# EasyEDA Pro project ProProject_Turbo_Drive_2024-05-30.epro

# Schematic Schematic

## Sheets
1 ESP32 S3 N16R8: Create Date: 2024-02-17; Page Name: ESP32 S3 N16R8; Project Name: Turbo; Schematic Name: Schematic; Update Date: 2024-05-26; Company: 嘉立创EDA; Page Size: A4; Version: V1.0
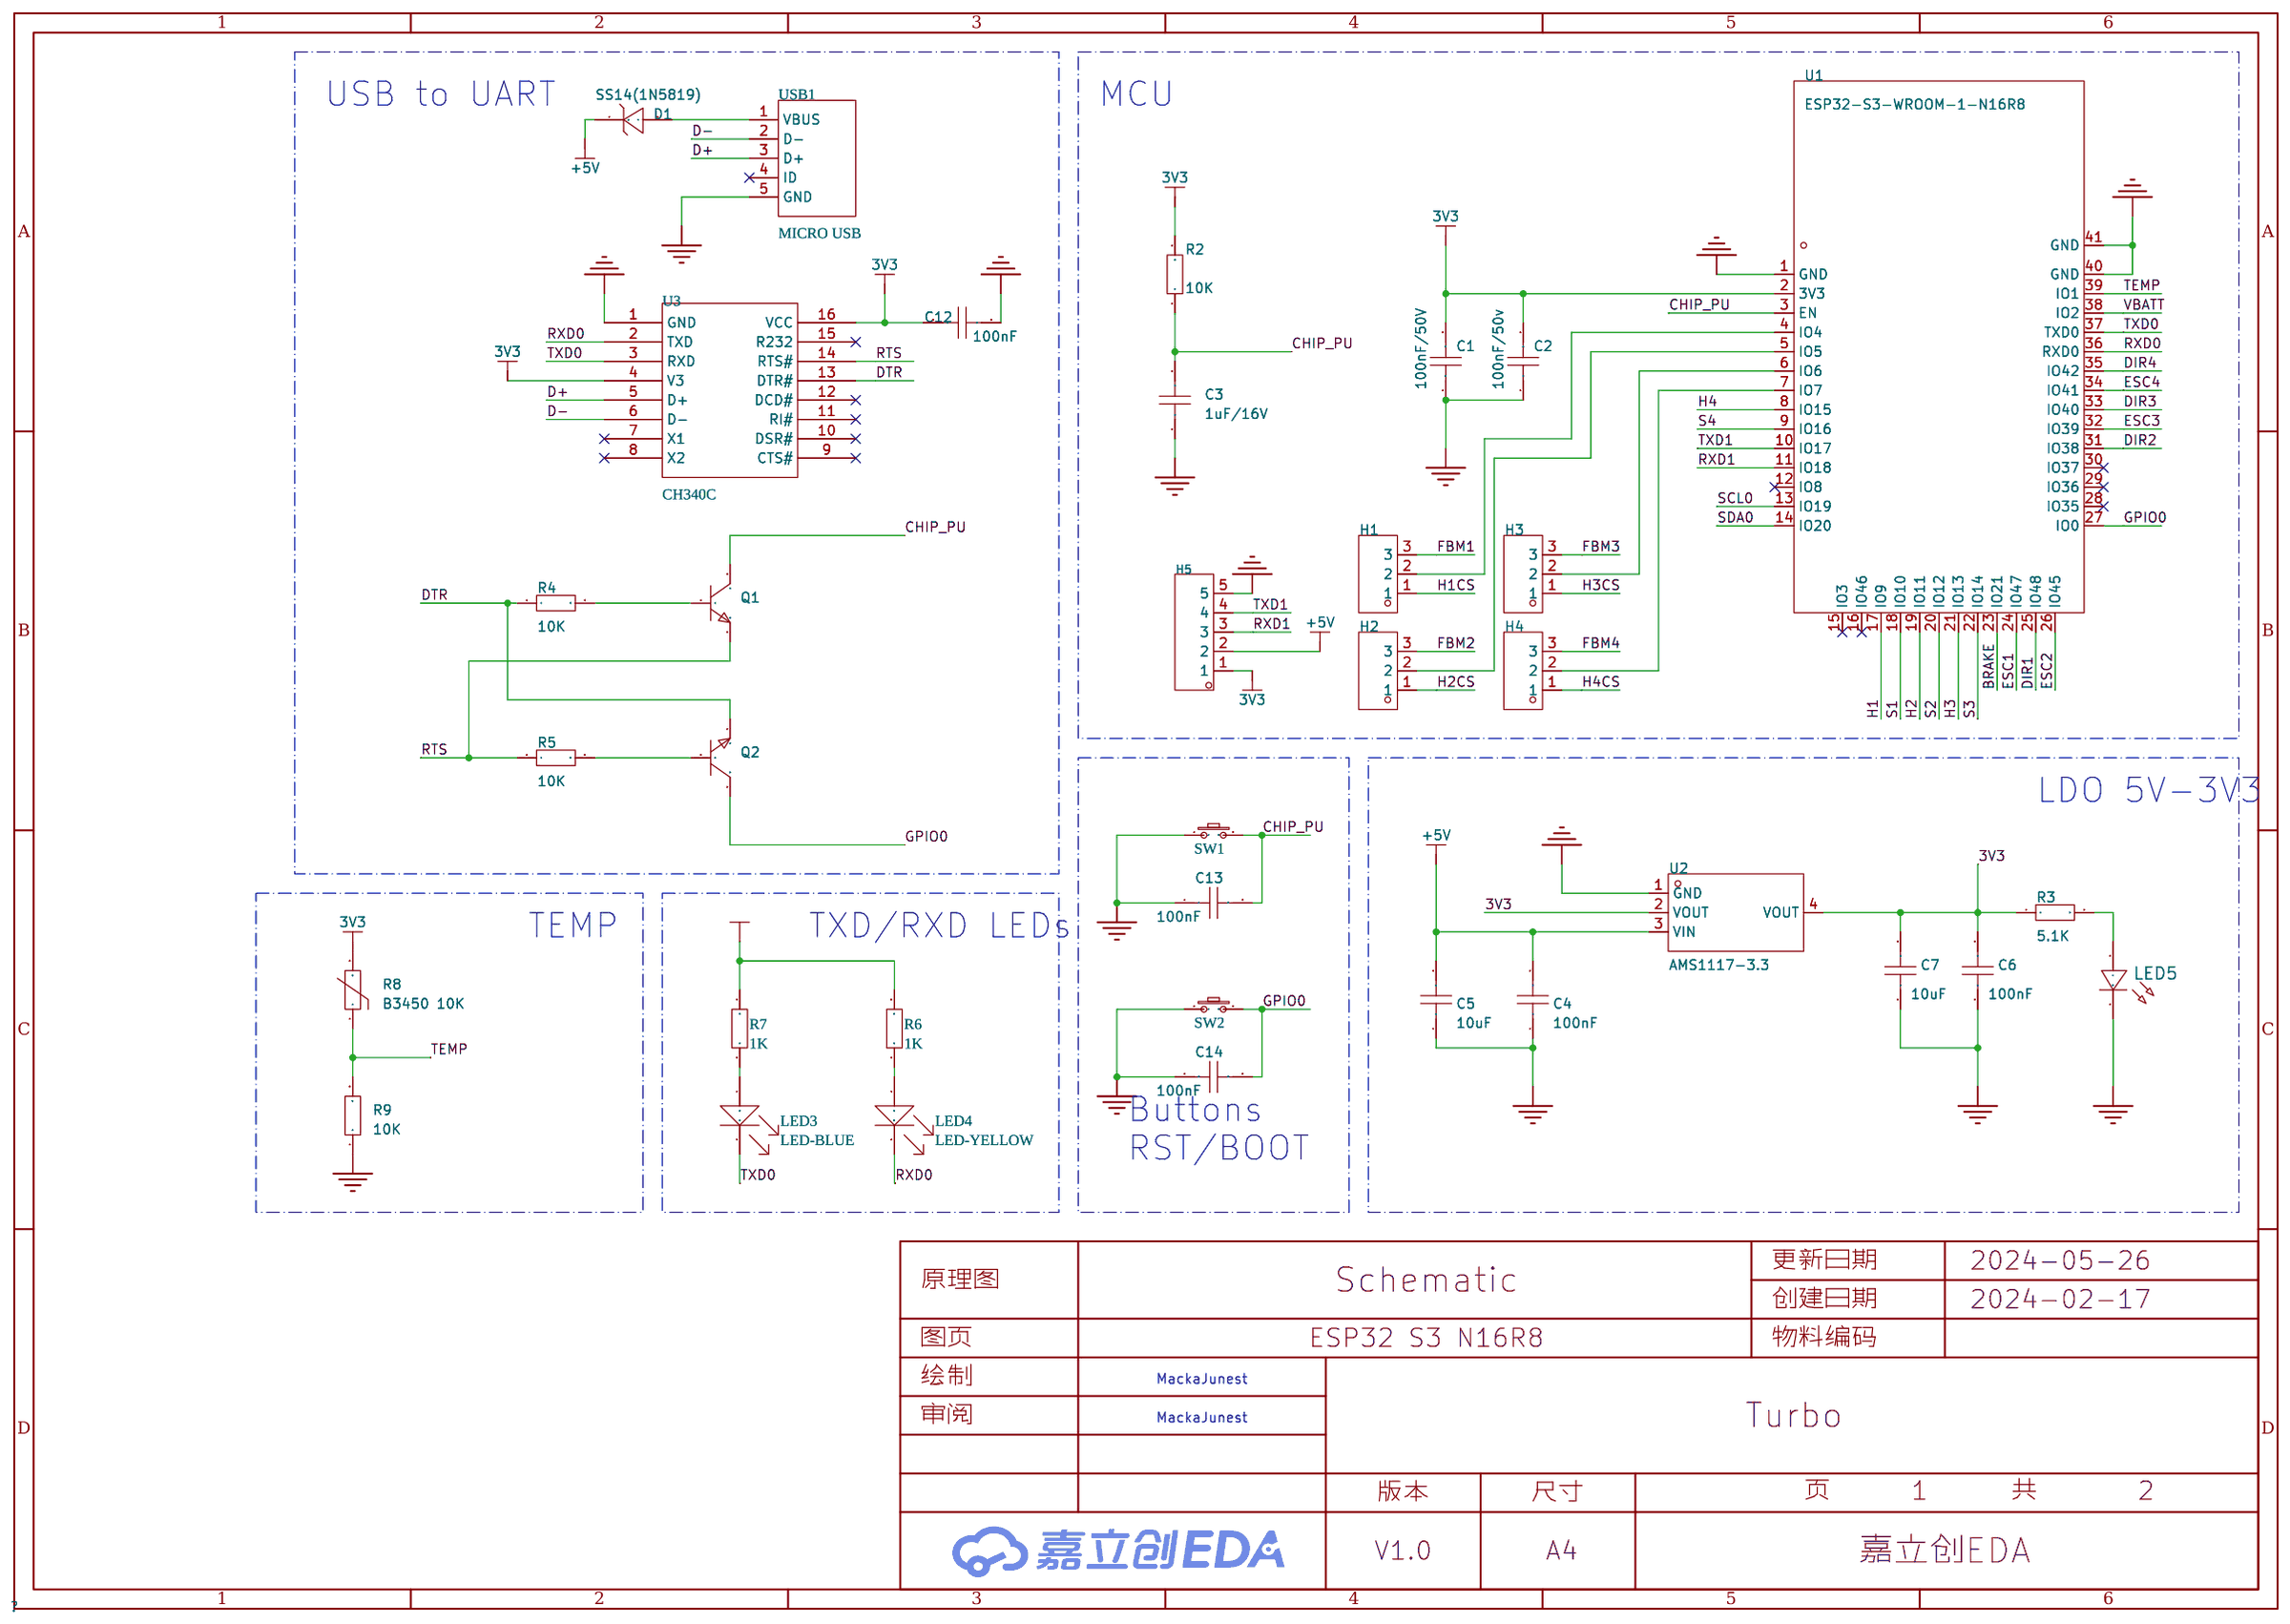
[diagram p0: ESP32 S3 N16R8]
2 Peripheral circuits: Create Date: 2024-02-19; Page Name: Peripheral circuits; Update Date: 2024-03-01
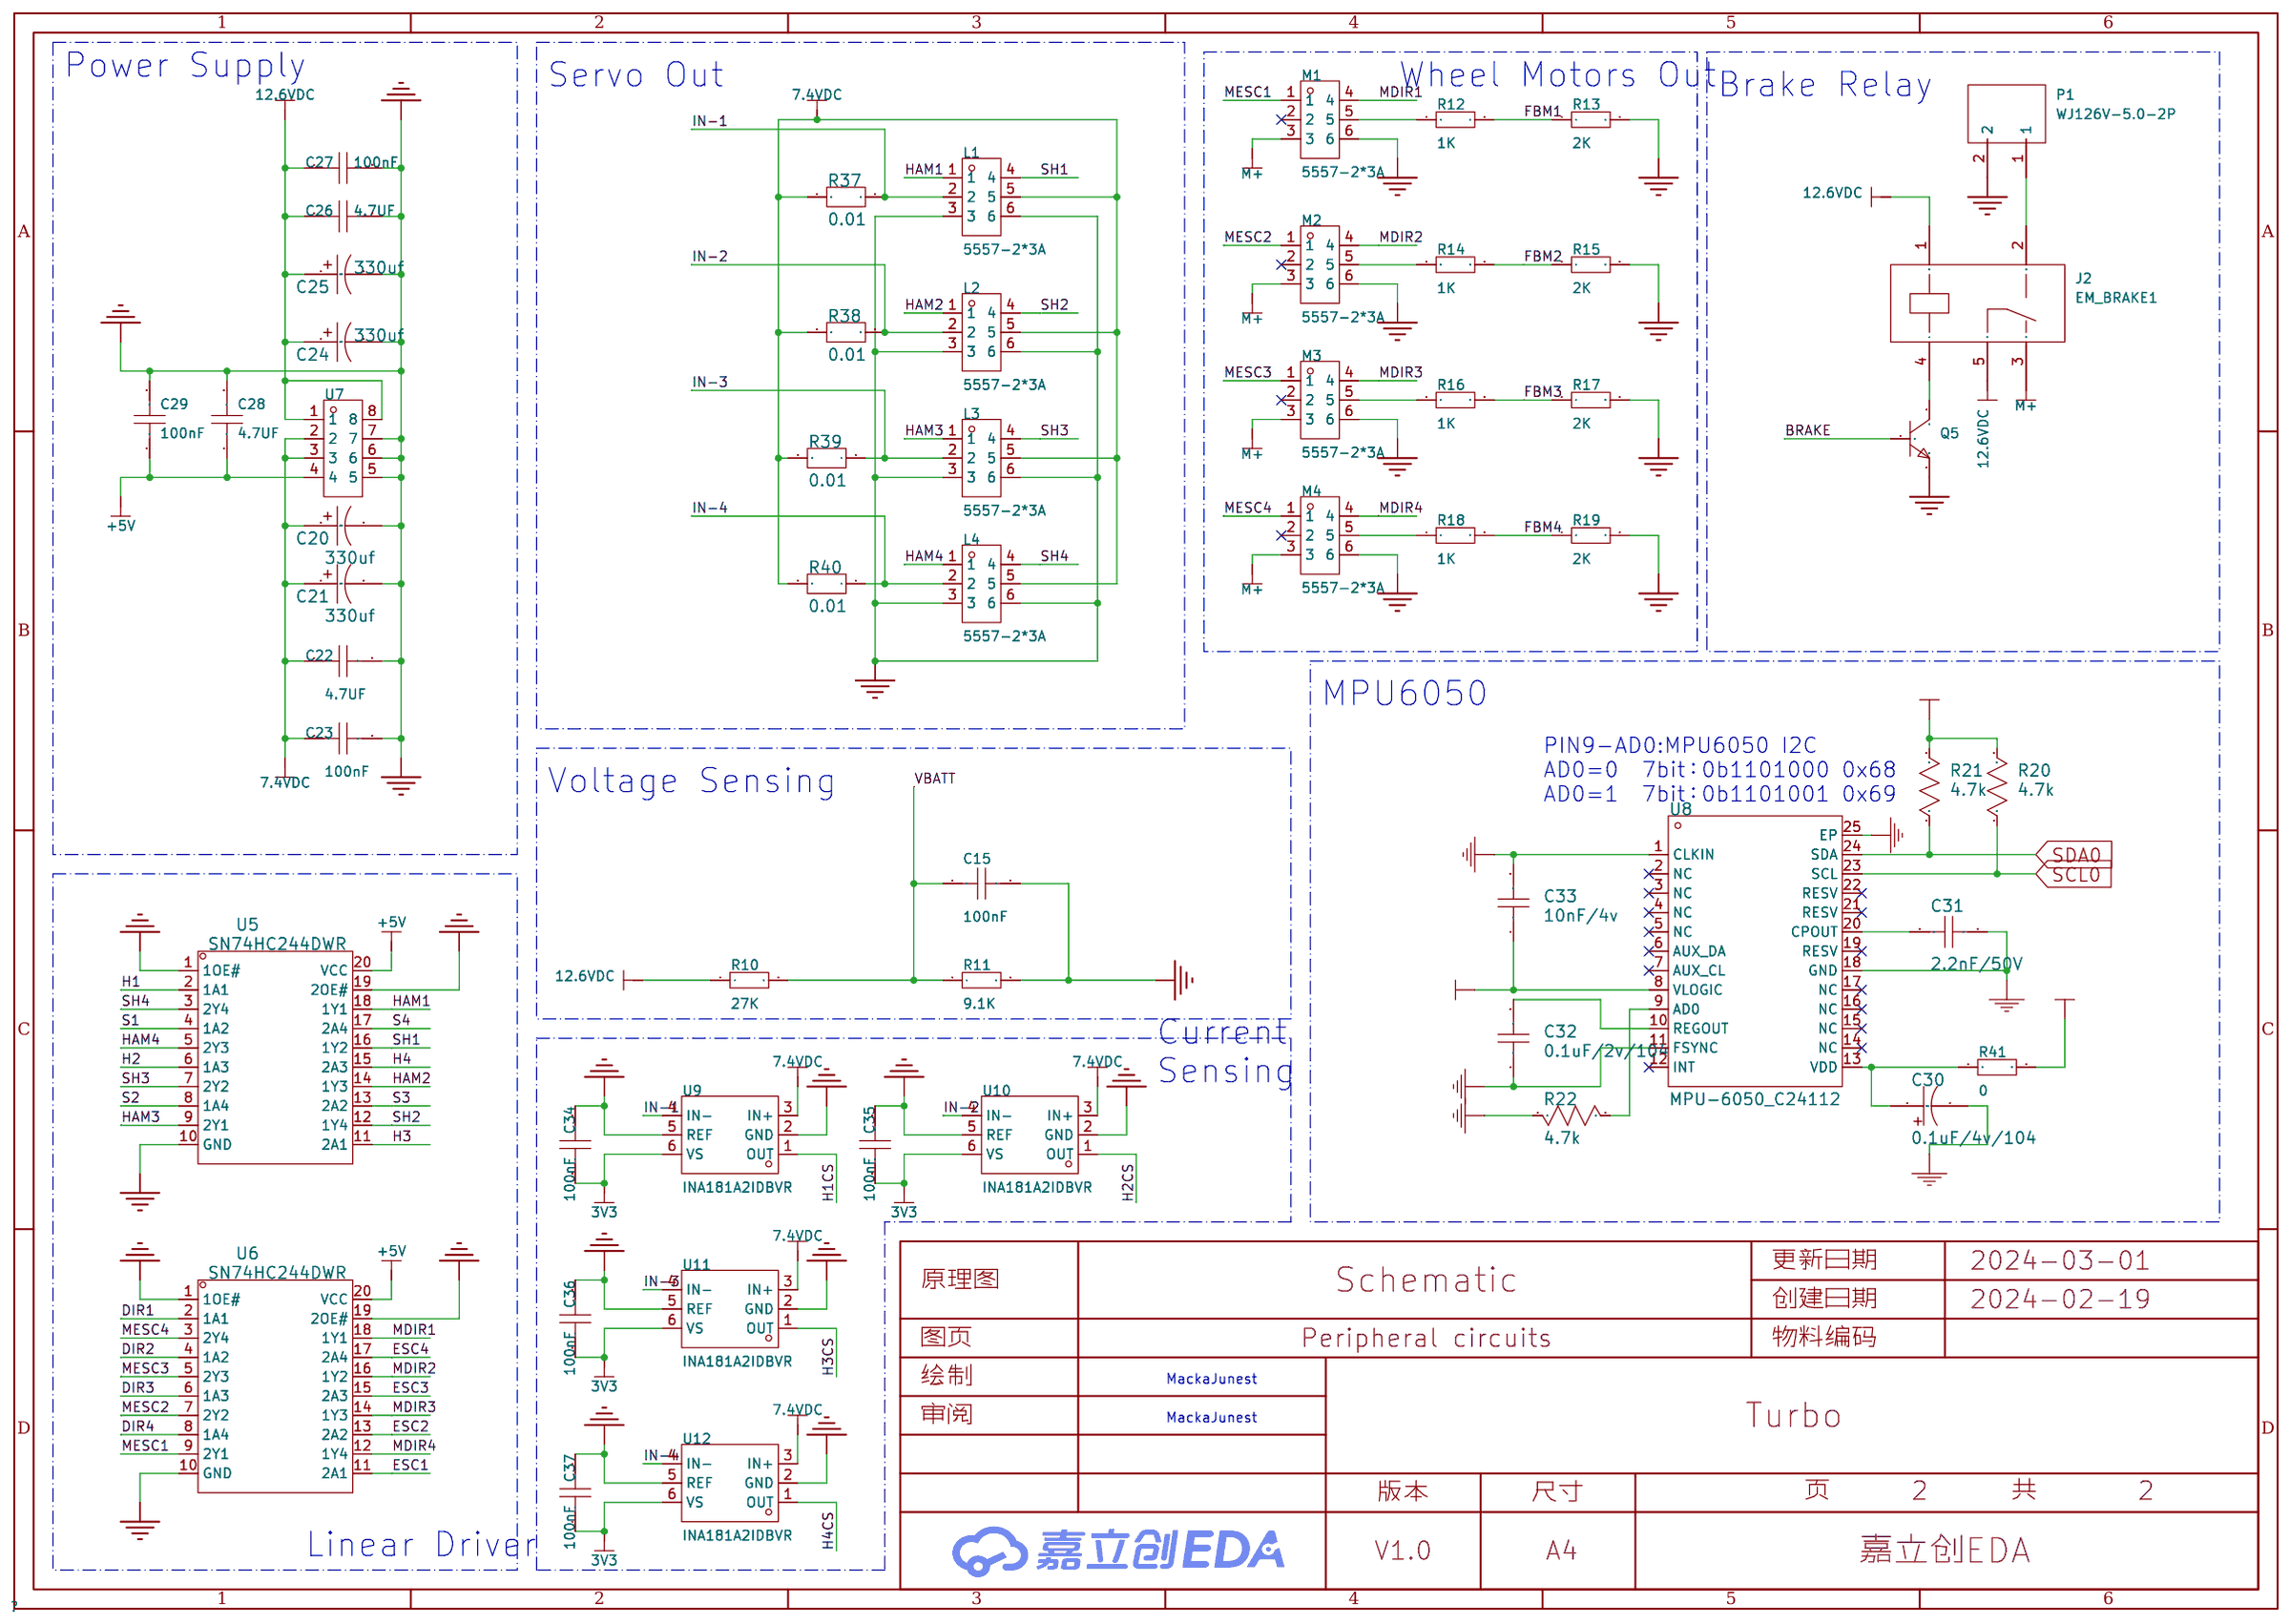
[diagram p1: Peripheral circuits]

## Parts
sheet ESP32 S3 N16R8
C1  100nF  [C0603]
C2  100nF  [C0603]
C3  1uF/16V  [C0603]
C4  100nF  [C0603]
C5  10uF  [C0603]
C6  100nF  [C0603]
C7  10uF  [C0603]
C12  100nF  [C0603]
C13  100nF  [C0603]
C14  100nF  [C0603]
D1  SS14(1N5819)  [SMA_L4.3-W2.7-LS5.1-RD]
H1  -  [HDR-TH_3P-P2.54-V-M]
H2  -  [HDR-TH_3P-P2.54-V-M]
H3  -  [HDR-TH_3P-P2.54-V-M]
H4  -  [HDR-TH_3P-P2.54-V-M]
H5  -  [HDR-TH_5P-P2.54-V-M]
LED3  LED-BLUE  [LED 0805B]
LED4  LED-YELLOW  [LED 0805Y]
LED5  -  [LED_0805]
Q1  -  [S8050_SOT-23]
Q2  -  [S8050_SOT-23]
R2  10K  [R0603]
R3  5.1K  [R0603]
R4  10K  [R0603]
R5  10K  [R0603]
R6  1K  [R 0603_L]
R7  1K  [R 0603_L]
R8  B3450 10K  [R0603]
R9  10K  [R0603]
SW1  3x6x5  [TSW SMD-3*6*2.5]
SW2  3x6x5  [TSW SMD-3*6*2.5]
U1  ESP32-S3-WROOM-1-N16R8  [WIRELM-SMD_ESP32-S3-WROOM-1]
U2  AMS1117-3.3  [SOT-223-3_L6.5-W3.4-P2.30-LS7.0-BR]
U3  CH340C  [SOP16_L]
USB1  MICRO USB  [USB-MICRO_B]
sheet Peripheral circuits
C15  100nF  [C0603]
C20  330uf  [CAP-T-10*10.5]
C21  330uf  [CAP-T-10*10.5]
C22  4.7UF  [C0603]
C23  100nF  [C0603]
C24  330uf  [CAP-T-10*10.5]
C25  330uf  [CAP-T-10*10.5]
C26  4.7UF  [C0603]
C27  100nF  [C0603]
C28  4.7UF  [C0603]
C29  100nF  [C0603]
C30  0.1uF/4v/104  [CAP-SMD_L3.2-W1.6]
C31  2.2nF/50V  [C0603]
C32  0.1uF/2v/104  [C0603]
C33  10nF/4v  [C0603]
C34  100nF  [C0603]
C35  100nF  [C0603]
C36  100nF  [C0603]
C37  100nF  [C0603]
J2  EM_BRAKE1  [RELAY-TH_SRD-XXVDC-XL-C]
L1  5557-2*3A  [CONN-TH_5557-2X3A]
L2  5557-2*3A  [CONN-TH_5557-2X3A]
L3  5557-2*3A  [CONN-TH_5557-2X3A]
L4  5557-2*3A  [CONN-TH_5557-2X3A]
M1  5557-2*3A  [CONN-TH_5557-2X3A]
M2  5557-2*3A  [CONN-TH_5557-2X3A]
M3  5557-2*3A  [CONN-TH_5557-2X3A]
M4  5557-2*3A  [CONN-TH_5557-2X3A]
P1  WJ126V-5.0-2P  [CONN-TH_WJ126V-5.0-2P]
Q5  -  [S8050_SOT-23]
R10  27K  [R0603]
R11  9.1K  [R0603]
R12  1K  [R0603]
R13  2K  [R0603]
R14  1K  [R0603]
R15  2K  [R0603]
R16  1K  [R0603]
R17  2K  [R0603]
R18  1K  [R0603]
R19  2K  [R0603]
R20  4.7k  [R0603]
R21  4.7k  [R0603]
R22  4.7k  [R0603]
R37  0.01  [R2512]
R38  0.01  [R2512]
R39  0.01  [R2512]
R40  0.01  [R2512]
R41  0  [R0603]
U5  SN74HC244DWR  [SOIC-20_L13.0-W7.6-P1.27-LS10.6-BL]
U6  SN74HC244DWR  [SOIC-20_L13.0-W7.6-P1.27-LS10.6-BL]
U7  5557-2*4P直针座-黑色8芯  [CONN-TH_5557-2-4P]
U8  MPU-6050_C24112  [QFN-24_L4.0-W4.0-P0.50-BL-EP2.6]
U9  INA181A2IDBVR  [SOT-23-6_L2.9-W1.6-P0.95-LS2.8-BL]
U10  INA181A2IDBVR  [SOT-23-6_L2.9-W1.6-P0.95-LS2.8-BL]
U11  INA181A2IDBVR  [SOT-23-6_L2.9-W1.6-P0.95-LS2.8-BL]
U12  INA181A2IDBVR  [SOT-23-6_L2.9-W1.6-P0.95-LS2.8-BL]

## Library data of the parts
C1-C7 C12-C15 C22 C23 C26-C29 C34-C37 = CAP_0603: Supplier Footprint: 0603
D1 = SS14(1N5819)-SMA: Supplier Part: C9900004556; Supplier Footprint: SMA; JLCPCB Part Class: 扩展库; Supplier: LCSC
H1-H4 = HDR-M_2.54_1x3P: Supplier Part: C2937625; Supplier Footprint: 插件
H5 = HDR-M_2.54_1x5P: Supplier Part: C358687; Supplier Footprint: 插件
LED3 = LED-BLUE: 3DModel: LED0805-RD_EH
LED4 = LED-YELLOW: 3DModel: LED0805-RD_EH
LED5 = LED_0805-R: Supplier Footprint: 0805
Q1 Q2 Q5 = S8050_SOT_NPN: Supplier Footprint: SOT-23
R2-R5 R9-R19 R41 = Res_0603: Supplier Footprint: 0603
R6 R7 = 1K: BOM名称: 贴片电阻; 3DModel: R0603
R8 = KNTC0603/10KF3950: 阻值(25℃):10kΩ;B值(25℃/50℃):3950K;电阻精度:±1%;功率:100mW;B值精度:±1%;最大稳态电流(25℃):310uA;; LCSC Part Name: 10kΩ 电阻精度:±1% 3950K; Supplier Part: C2892547; Manufacturer: KUU; Supplier Footprint: 0603; JLCPCB Part Class: 扩展库; Datasheet: https://atta.szlcsc.com/upload/public/pdf/source/20210908/154E92DD1F52D9B3804AA862EC2D5FAB.pdf; Supplier: LCSC; Resistance @ 25℃: 10kΩ; B Constant (25℃/50℃): 3950K; Resistance Tolerance: ±1%; B Constant (25℃/85℃): 3987K; Power: 100mW; B Constant Tolerance: ±1%; Steady State Current (Max): 310uA; Operating Temperature: -40℃~+125℃
SW1 SW2 = 3x6x5: BOM名称: 3x6轻触开关; 3DModel: SW-SMD_TSW-8-16-T40-1
U1 = ESP32-S3-WROOM-1-N16R8: LCSC Part Name: 通用型Wi-Fi+低功耗蓝牙MCU模组; Supplier Part: C2913202; Manufacturer: ESPRESSIF(乐鑫); Supplier Footprint: SMD,18x25.5mm; JLCPCB Part Class: 扩展库; Datasheet: https://atta.szlcsc.com/upload/public/pdf/source/20220705/4E799F39581577F766659887F738A439.pdf; Supplier: LCSC
U2 = AMS1117-3.3_C6186: 输出类型:固定;最大输入电压:-;输出电压:3.3V;最大输出电流:1A;电源纹波抑制比(PSRR):72dB@(120Hz);输出极性:正极;; LCSC Part Name: 输出3.3V 1A; Supplier Part: C6186; Manufacturer: AMS; Supplier Footprint: SOT-223-3; JLCPCB Part Class: 基础库; Datasheet: https://atta.szlcsc.com/upload/public/pdf/source/20180727/C6186_7A095716F0823C02F1997A905E26C086.pdf; Supplier: LCSC; Output Type: 固定; Output Voltage: 3.3V; MAX Output Current: 1A; Power Supply Rejection Ratio (PSRR): 72dB@(120Hz); Dropout Voltage: 1.3V@(800mA); Output Polarity: 正极; Number of Outputs: 1
U3 = CH340C: 3DModel: SOP-16_L10.0-W3.9-P1.27-LS6.0-TR
USB1 = MICRO USB: 3DModel: MICRO-USB-SMD_MICRO5.9MMUSB
C20 C21 C24 C25 = 330uf: 3DModel: CAP-SMD_BD10.5-L10.8-W10.8-LS12.2
C30 = 0.1uF/4v/104: Supplier: LCSC; Supplier Part: C282116; Manufacturer: AVX; Manufacturer Part: TPSA106K016R1000
C31 = 2.2nF/50V
C32 = 0.1uF/2v/104
C33 = 10nF/4v
J2 = SRD-12VDC-SL-C: 线圈电压:12V;触点形式:一组转换:1C(单刀双掷-转换);触点容量(电阻负载):-;最大切换电压:250V@AC;最大切换电流:15A;; Supplier Part: C30431; Manufacturer: 松乐; Supplier Footprint: 插件,15.6x19.2mm; JLCPCB Part Class: 扩展库; Datasheet: https://atta.szlcsc.com/upload/public/pdf/source/20200305/C490149_C96E4098A3B1FFB377D5AD2E40B7C2A8.pdf; Supplier: LCSC; Coil Voltage: 12V; Contact Form: 一组转换:1C(单刀双掷-转换); Pin Number: 5; Maximum Switching Voltage: 250V@AC; Coil Rated Power: 360mW; Maximum Switching Current: 15A; Coil Type: 无极性-单线圈; Coil Resistance: 400Ω; Contact Resistance: 100mΩ; Operate Time: 10ms; Release Time: 10ms
L1-L4 M1-M4 = 5557-2*3A: LCSC Part Name: 2x3P 4.2mm; Supplier Part: C2831892; Manufacturer: FG(富港); Supplier Footprint: 插件,P=4.2mm; JLCPCB Part Class: 扩展库; Datasheet: https://atta.szlcsc.com/upload/public/pdf/source/20210510/C2831892_3DE45FCABBC626DF5DE8D2A65BC8CF51.pdf; Supplier: LCSC
P1 = WJ126V-5.0-2P: 结构:1x2P;间距:5mm;颜色:绿色;安装方式:直插;额定电流:18A;额定电压:250V;排数:1;线规 - AWG:14~26;线规 - 平方毫米:2.5;每排PIN数:2;工作温度范围:-40℃~+105℃;; LCSC Part Name: 5mm 1x2P 排数:1 每排P数:2 直插; Supplier Part: C8404; Manufacturer: KANGNEX(康奈克斯电气); Supplier Footprint: 插件,P=5mm; JLCPCB Part Class: 扩展库; Datasheet: https://atta.szlcsc.com/upload/public/pdf/source/20191225/C8404_8F52D87DF851D149A4DEA9BD9FA83F9A.pdf; Supplier: LCSC; Structure: 1x2P; Pitch: 5mm; Color: 绿色; Mounting Style: 直插; Current Rating (Max): 18A; Voltage Rating (Max): 250V; Number of Pins: 2P; Number of Rows: 1; Wire Gauge - AWG: 14~26; Wire Gauge - mm2: 2.5; Number of PINs Per Row: 2; Operating Temperature Range: -40℃~+105℃
R20-R22 = 4.7k
R37-R40 = 0.01: link: https://item.szlcsc.com/347967.html; 3DModel: R2512_L6.3-W3.2-H0.6
U5 U6 = SN74HC244DWR: link: https://item.szlcsc.com/7317.html; 3DModel: SOIC-20_L12.8-W7.5-H2.7-LS10.3-P1.27; Supplier: LCSC; Manufacturer: TI; Manufacturer Part: SN74AHC244DWR; image: //image.lceda.cn/szlcsc/C7473.jpg; Supplier Part: C7473; JLCPCB Part Class: Extend
U7 = 5557-2*4P直针座-黑色8芯: Supplier Part: C9900011253; Supplier Footprint: CONN-TH_8P-P4.20; JLCPCB Part Class: 扩展库; Supplier: LCSC
U8 = MPU-6050_C24112: Supplier: LCSC; Manufacturer: InvenSense; Manufacturer Part: MPU-6050; image: //image.lceda.cn/szlcsc/C24112.jpg; Supplier Part: C24112; JLCPCB Part Class: Basic
U9-U12 = INA181A2IDBVR: 放大器数:单路;; Supplier Part: C2058784; Manufacturer: TI(德州仪器); Supplier Footprint: SOT-23-6; JLCPCB Part Class: 扩展库; Datasheet: https://www.ti.com/cn/lit/gpn/ina2181; Supplier: LCSC; Number of Channels: 单路; Supply Current: 260uA; Operating Temperature: -40℃~+125℃

## Nets
3V3: C1.2 C2.2 C6.2 C7.2 C12.1 C33.1 C34.1 C35.1 C36.1 C37.1 H5.1 R2.2 R3.1 R6.2 R7.2 R8.2 R20.2 R21.2 R41.2 U1.2(3V3) U2.2(VOUT) U2.4(VOUT) U3.4(V3) U3.16(VCC) U8.8(VLOGIC) U9.6(VS) U10.6(VS) U11.6(VS) U12.6(VS)
7.4VDC: C20.1 C21.1 C22.1 C23.1 L1.5 L2.5 L3.5 L4.5 R37.2 R38.2 R39.2 R40.2 U7.2 U7.3 U9.3(IN+) U10.3(IN+) U11.3(IN+) U12.3(IN+)
12.6VDC: C24.1 C25.1 C26.1 C27.1 J2.1 J2.5 R10.1 U7.1 U7.8
+5V: C4.2 C5.2 C28.1 C29.1 D1.1(C) H5.2 U2.3(VIN) U5.20(VCC) U6.20(VCC) U7.4
GND: C1.1 C2.1 C3.1 C4.1 C5.1 C6.1 C7.1 C12.2 C13.1 C14.1 C15.2 C20.2 C21.2 C22.2 C23.2 C24.2 C25.2 C26.2 C27.2 C28.2 C29.2 C30.2 C31.1 C32.1 C33.2 C34.2 C35.2 C36.2 C37.2 H5.5 L1.3 L1.6 L2.3 L2.6 L3.3 L3.6 L4.3 L4.6 LED5.1(C) M1.6 M2.6 M3.6 M4.6 P1.2 Q5.2 R9.1 R11.2 R13.2 R15.2 R17.2 R19.2 R22.1 SW1.1 SW2.1 U1.1(GND) U1.40(GND) U1.41(GND) U2.1(GND) U3.1(GND) U5.1(1OE#) U5.10(GND) U5.19(2OE#) U6.1(1OE#) U6.10(GND) U6.19(2OE#) U7.5 U7.6 U7.7 U8.1(CLKIN) U8.11(FSYNC) U8.18(GND) U8.25(EP) U9.2(GND) U9.5(REF) U10.2(GND) U10.5(REF) U11.2(GND) U11.5(REF) U12.2(GND) U12.5(REF) USB1.5(GND)
VBATT: C15.1 R10.2 R11.1 U1.38(IO2)
BRAKE: Q5.1 U1.23(IO21)
CHIP_PU: C3.2 C13.2 Q1.3 R2.1 SW1.2 U1.3(EN)
D+: U3.5(D+) USB1.3(D+)
D-: U3.6(D-) USB1.2(D-)
DIR1: U1.25(IO48) U6.2(1A1)
DIR2: U1.31(IO38) U6.4(1A2)
DIR3: U1.33(IO40) U6.6(1A3)
DIR4: U1.35(IO42) U6.8(1A4)
DTR: Q2.2 R4.1 U3.13(DTR#)
ESC1: U1.24(IO47) U6.11(2A1)
ESC2: U1.26(IO45) U6.13(2A2)
ESC3: U1.32(IO39) U6.15(2A3)
ESC4: U1.34(IO41) U6.17(2A4)
FBM1: H1.3 R12.2 R13.1
FBM2: H2.3 R14.2 R15.1
FBM3: H3.3 R16.2 R17.1
FBM4: H4.3 R18.2 R19.1
GPIO0: C14.2 Q2.3 SW2.2 U1.27(IO0)
H1: U1.17(IO9) U5.2(1A1)
H1CS: H1.1 U9.1(OUT)
H2: U1.19(IO11) U5.6(1A3)
H2CS: H2.1 U10.1(OUT)
H3: U1.21(IO13) U5.11(2A1)
H3CS: H3.1 U11.1(OUT)
H4: U1.8(IO15) U5.15(2A3)
H4CS: H4.1 U12.1(OUT)
HAM1: L1.1 U5.18(1Y1)
HAM2: L2.1 U5.14(1Y3)
HAM3: L3.1 U5.9(2Y1)
HAM4: L4.1 U5.5(2Y3)
IN-1: L1.2 R37.1 U9.4(IN-)
IN-2: L2.2 R38.1 U10.4(IN-)
IN-3: L3.2 R39.1 U11.4(IN-)
IN-4: L4.2 R40.1 U12.4(IN-)
M+: J2.3 M1.3 M2.3 M3.3 M4.3
MDIR1: M1.4 U6.18(1Y1)
MDIR2: M2.4 U6.16(1Y2)
MDIR3: M3.4 U6.14(1Y3)
MDIR4: M4.4 U6.12(1Y4)
MESC1: M1.1 U6.9(2Y1)
MESC2: M2.1 U6.7(2Y2)
MESC3: M3.1 U6.5(2Y3)
MESC4: M4.1 U6.3(2Y4)
RTS: Q1.2 R5.1 U3.14(RTS#)
RXD0: LED4.2 U1.36(RXD0) U3.2(TXD)
RXD1: H5.3 U1.11(IO18)
S1: U1.18(IO10) U5.4(1A2)
S2: U1.20(IO12) U5.8(1A4)
S3: U1.22(IO14) U5.13(2A2)
S4: U1.9(IO16) U5.17(2A4)
SCL0: R20.1 U1.13(IO19) U8.23(SCL)
SDA0: R21.1 U1.14(IO20) U8.24(SDA)
SH1: L1.4 U5.16(1Y2)
SH2: L2.4 U5.12(1Y4)
SH3: L3.4 U5.7(2Y2)
SH4: L4.4 U5.3(2Y4)
TEMP: R8.1 R9.2 U1.39(IO1)
TXD0: LED3.2 U1.37(TXD0) U3.3(RXD)
TXD1: H5.4 U1.10(IO17)
$1N1222: LED5.2(A) R3.2
$1N2133: Q1.1 R4.2
$1N2136: Q2.1 R5.2
$1N2741: LED4.1 R6.1
$1N2742: LED3.1 R7.1
$1N4890: D1.2(A) USB1.1(VBUS)
$1N6785: H1.2 U1.4(IO4)
$1N6797: H2.2 U1.5(IO5)
$1N6809: H3.2 U1.6(IO6)
$1N6817: H4.2 U1.7(IO7)
$2N3281: M1.5 R12.1
$2N3526: M2.5 R14.1
$2N3663: M3.5 R16.1
$2N3800: M4.5 R18.1
$2N3957: J2.4 Q5.3
$2N7741: R22.2 U8.9(AD0)
$2N7753: C32.2 U8.10(REGOUT)
$2N7759: C31.2 U8.20(CPOUT)
$2N11315: J2.2 P1.1
$2N16506: C30.1 R41.1 U8.13(VDD)

Not connected (* = marked no-connect by the designer): M1 2*; M2 2*; M3 2*; M4 2*; U1 12(IO8)* 15(IO3)* 16(IO46)* 28(IO35)* 29(IO36)* 30(IO37)*; U3 7(X1)* 8(X2)* 9(CTS#)* 10(DSR#)* 11(RI#)* 12(DCD#)* 15(R232)*; U8 2(NC)* 3(NC)* 4(NC)* 5(NC)* 6(AUX_DA)* 7(AUX_CL)* 12(INT)* 14(NC)* 15(NC)* 16(NC)* 17(NC)* 19(RESV)* 21(RESV)* 22(RESV)*; USB1 4(ID)*

## Notes on the sheets
sheet 1
- USB to UART
- MCU
- LDO 5V-3V3
- TEMP
- TXD/RXD LEDs
- Buttons
  RST/BOOT
- MackaJunest
- MackaJunest
sheet 2
- Power Supply
- Servo Out
- Wheel Motors Out
- Brake Relay
- MPU6050
- PIN9-AD0:MPU6050 I2C
  AD0=0  7bit：0b1101000 0x68
  AD0=1  7bit：0b1101001 0x69
- Voltage Sensing
- Current
  Sensing
- MackaJunest
- MackaJunest
- Linear Driver

# Board PCB1
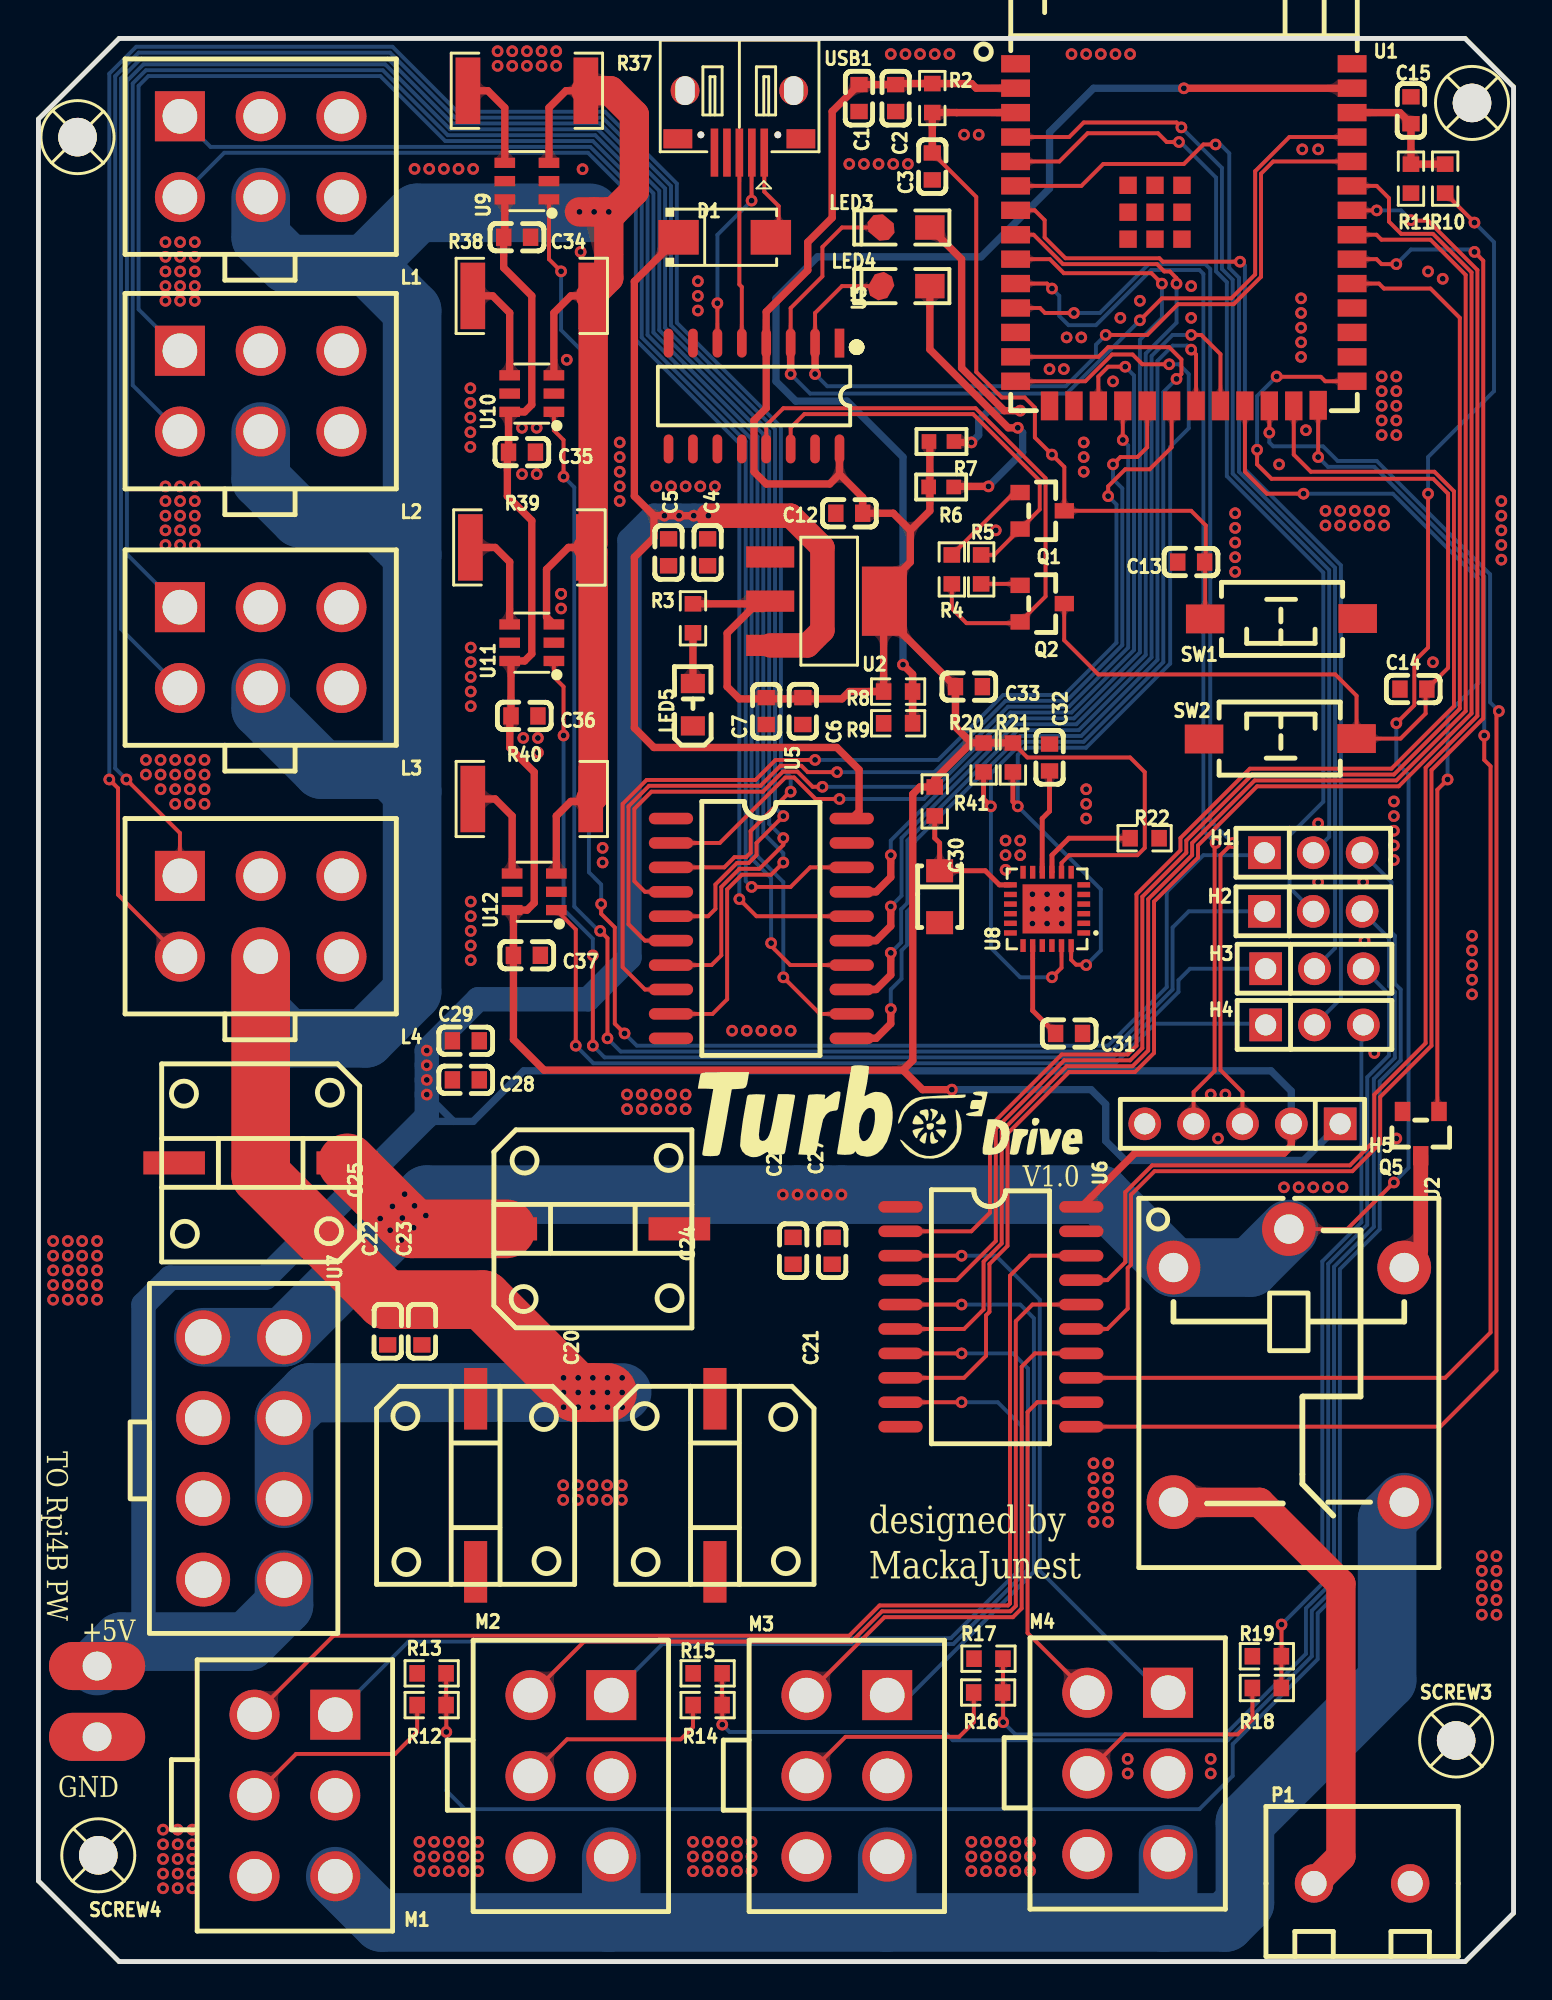
[diagram p2: board, top side]
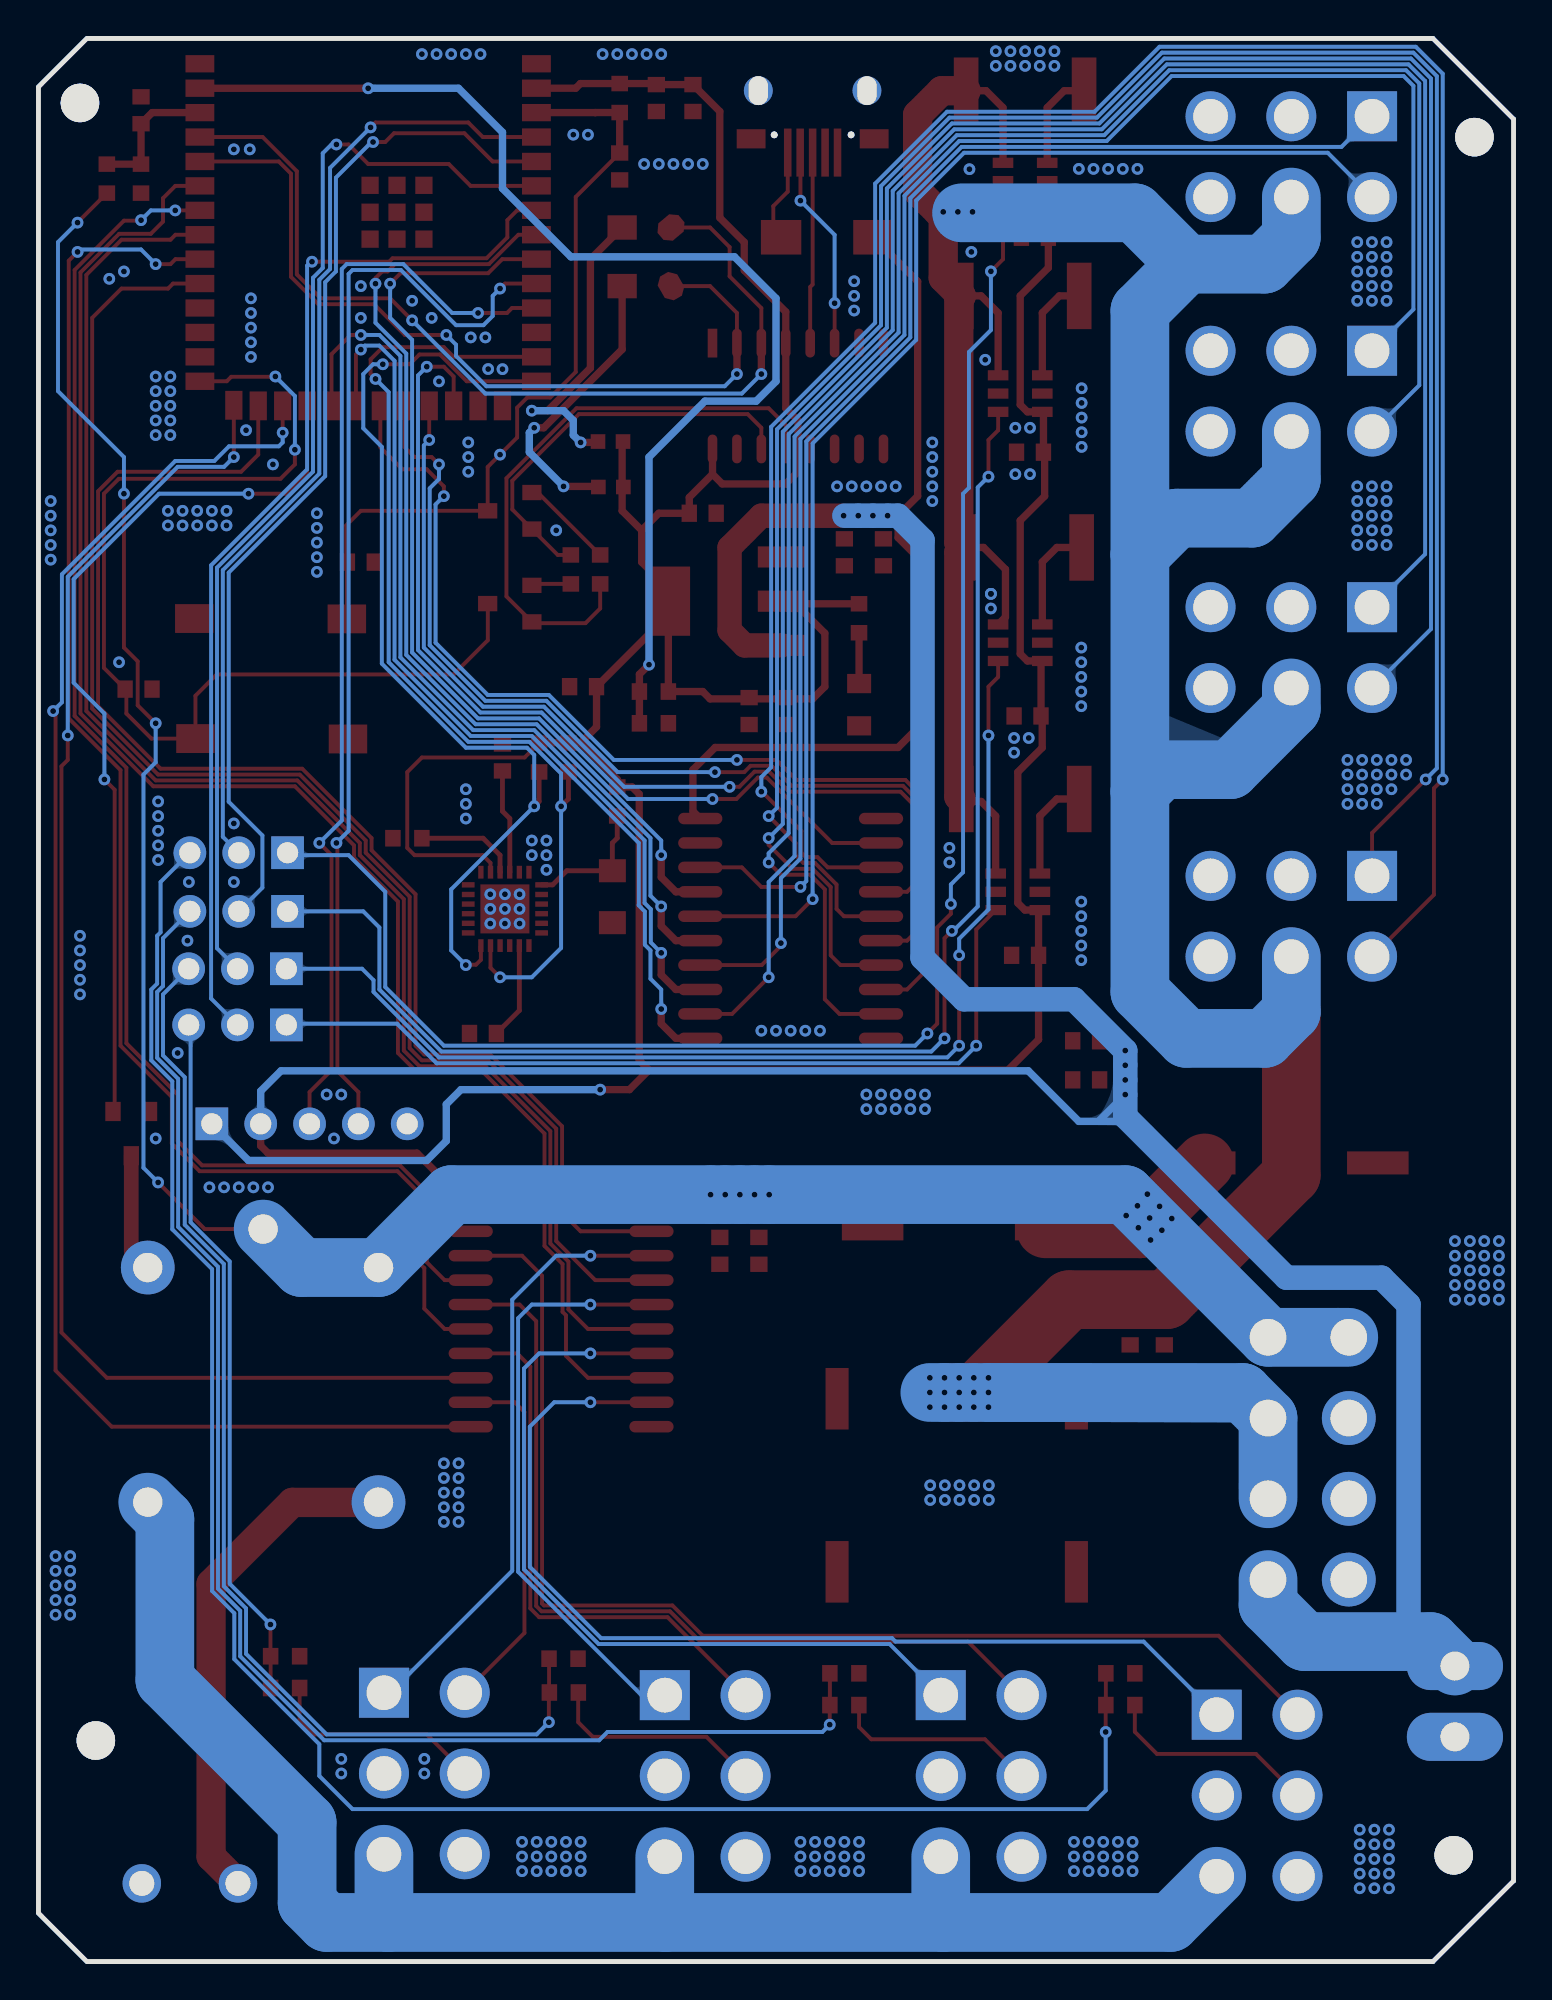
[diagram p3: board, bottom side, seen from below]

Outline 76.71 x 100 mm; copper layers: Top Layer, Bottom Layer. Coordinates in mm from the lower left corner of the outline.
Outline path: 0,95.81 0,4.19 4.19,0 74.19,0 76.71,2.52 76.71,97.48 74.19,100 4.19,100 0,95.81
Stack: Top Layer 0.035mm / Dielectric1 1.51mm FR4 er 4.5 / Bottom Layer 0.035mm

## Design rules (mm)
template: 自定义配置
spacing copperThickness1oz (default): track to track 0.102, other pairs 0.152 to 0.3
spacing copperThickness2oz: track to track 0.203, other pairs 0.152 to 0.3
track width copperThickness1oz (default): min 0.127, default 0.254, max 10
track width copperThickness2oz: min 0.203, default 0.254, max 2.54
differential pair differentialPair (default): width min 0.127, default 0.254, max 2.54; gap min 0.152, default 0.152
via viaSize (default): diameter min 0.5, default 0.61, max 10; hole min 0.3, default 0.305, max 6.299
net IN-1 uses copperRegion1
net IN-2 uses copperRegion1
net IN-3 uses copperRegion1
net IN-4 uses copperRegion1

## Placement (name value [footprint] x y rotation side)
C1  100nF  [C0603]  42.67 96.9 90 top
C2  100nF  [C0603]  44.58 96.9 90 top
C3  1uF/16V  [C0603]  46.48 93.34 90 top
C4  100nF  [C0603]  34.8 73.28 90 top
C5  10uF  [C0603]  32.77 73.28 90 top
C6  100nF  [C0603]  39.75 65.02 90 top
C7  10uF  [C0603]  37.85 65.02 90 top
C12  100nF  [C0603]  42.16 75.31 180 top
C13  100nF  [C0603]  59.94 72.77 0 top
C14  100nF  [C0603]  71.5 66.17 0 top
C15  100nF  [C0603]  71.37 96.27 90 top
C20  330uf  [CAP-T-10*10.5]  22.73 24.77 270 top
C21  330uf  [CAP-T-10*10.5]  35.18 24.77 270 top
C22  4.7UF  [C0603]  18.16 32.77 270 top
C23  100nF  [C0603]  19.94 32.77 270 top
C24  330uf  [CAP-T-10*10.5]  28.83 38.1 0 top
C25  330uf  [CAP-T-10*10.5]  11.56 41.53 180 top
C26  4.7UF  [C0603]  39.24 36.96 270 top
C27  100nF  [C0603]  41.28 36.96 270 top
C28  4.7UF  [C0603]  22.22 45.85 0 top
C29  100nF  [C0603]  22.22 47.88 0 top
C30  0.1uF/4v/104  [CAP-SMD_L3.2-W1.6]  46.86 55.37 270 top
C31  2.2nF/50V  [C0603]  53.59 48.26 180 top
C32  0.1uF/2v/104  [C0603]  52.58 62.61 270 top
C33  10nF/4v  [C0603]  48.39 66.29 0 top
C34  100nF  [C0603]  24.89 89.66 0 top
C35  100nF  [C0603]  25.15 78.49 0 top
C36  100nF  [C0603]  25.27 64.77 0 top
C37  100nF  [C0603]  25.4 52.32 0 top
D1  SS14(1N5819)  [SMA_L4.3-W2.7-LS5.1-RD]  35.69 89.66 0 top
H1  -  [HDR-TH_3P-P2.54-V-M]  66.29 57.66 0 top
H2  -  [HDR-TH_3P-P2.54-V-M]  66.29 54.61 0 top
H3  -  [HDR-TH_3P-P2.54-V-M]  66.36 51.63 0 top
H4  -  [HDR-TH_3P-P2.54-V-M]  66.36 48.7 0 top
H5  -  [HDR-TH_5P-P2.54-V-M]  62.61 43.56 180 top
J2  EM_BRAKE1  [RELAY-TH_SRD-XXVDC-XL-C]  65.02 30.99 270 top
L1  5557-2*3A  [CONN-TH_5557-2X3A]  11.56 93.85 180 top
L2  5557-2*3A  [CONN-TH_5557-2X3A]  11.56 81.66 180 top
L3  5557-2*3A  [CONN-TH_5557-2X3A]  11.56 68.33 180 top
L4  5557-2*3A  [CONN-TH_5557-2X3A]  11.56 54.36 180 top
LED3  LED-BLUE  [LED 0805B]  45.09 90.17 180 top
LED4  LED-YELLOW  [LED 0805Y]  45.09 87.12 180 top
LED5  -  [LED_0805]  34.04 65.41 90 top
M1  5557-2*3A  [CONN-TH_5557-2X3A]  13.34 8.64 90 top
M2  5557-2*3A  [CONN-TH_5557-2X3A]  27.69 9.65 90 top
M3  5557-2*3A  [CONN-TH_5557-2X3A]  42.04 9.65 90 top
M4  5557-2*3A  [CONN-TH_5557-2X3A]  56.64 9.78 90 top
NOREF  -  [Pad_e72]  3.05 15.37 0 top
NOREF#2  -  [Pad_e60]  3.05 11.68 0 top
P1  WJ126V-5.0-2P  [CONN-TH_WJ126V-5.0-2P]  68.83 4.06 90 top
Q1  -  [S8050_SOT-23]  52.2 75.56 180 top
Q2  -  [S8050_SOT-23]  52.2 70.74 180 top
Q5  -  [S8050_SOT-23]  72.01 43.05 90 top
R2  10K  [R0603]  46.48 96.9 90 top
R3  5.1K  [R0603]  34.04 69.85 270 top
R4  10K  [R0603]  47.5 72.39 90 top
R5  10K  [R0603]  49.02 72.39 270 top
R6  1K  [R 0603_L]  46.94 76.68 180 top
R7  1K  [R 0603_L]  46.96 79.04 180 top
R8  B3450 10K  [R0603]  44.7 66.04 180 top
R9  10K  [R0603]  44.7 64.39 0 top
R10  27K  [R0603]  73.15 92.71 90 top
R11  9.1K  [R0603]  71.37 92.71 270 top
R12  1K  [R0603]  20.45 13.34 0 top
R13  2K  [R0603]  20.45 14.99 180 top
R14  1K  [R0603]  34.8 13.34 0 top
R15  2K  [R0603]  34.8 14.99 180 top
R16  1K  [R0603]  49.39 13.99 0 top
R17  2K  [R0603]  49.4 15.75 180 top
R18  1K  [R0603]  63.88 14.22 0 top
R19  2K  [R0603]  63.88 15.88 180 top
R20  4.7k  [R0603]  49.15 62.61 90 top
R21  4.7k  [R0603]  50.67 62.61 90 top
R22  4.7k  [R0603]  57.52 58.41 180 top
R37  0.01  [R2512]  25.4 97.28 0 top
R38  0.01  [R2512]  25.65 86.61 0 top
R39  0.01  [R2512]  25.53 73.53 0 top
R40  0.01  [R2512]  25.65 60.45 0 top
R41  0  [R0603]  46.61 60.33 90 top
SCREW3  -  [M2螺丝]  73.72 11.49 0 top
SCREW3#2  -  [M2螺丝]  2.03 94.87 0 top
SCREW4  -  [M2螺丝]  3.11 5.52 0 top
SCREW4#2  -  [M2螺丝]  74.55 96.65 0 top
SW1  3x6x5  [TSW SMD-3*6*2.5]  64.61 69.82 180 top
SW2  3x6x5  [TSW SMD-3*6*2.5]  64.61 63.59 0 top
U1  ESP32-S3-WROOM-1-N16R8  [WIRELM-SMD_ESP32-S3-WROOM-1]  59.56 89.79 0 top
U2  AMS1117-3.3  [SOT-223-3_L6.5-W3.4-P2.30-LS7.0-BR]  41.02 70.74 180 top
U3  CH340C  [SOP16_L]  37.21 81.41 270 top
U5  SN74HC244DWR  [SOIC-20_L13.0-W7.6-P1.27-LS10.6-BL]  37.59 53.72 270 top
U6  SN74HC244DWR  [SOIC-20_L13.0-W7.6-P1.27-LS10.6-BL]  49.53 33.53 270 top
U7  5557-2*4P直针座-黑色8芯  [CONN-TH_5557-2-4P]  10.67 26.16 270 top
U8  MPU-6050_C24112  [QFN-24_L4.0-W4.0-P0.50-BL-EP2.6]  52.45 54.74 90 top
U9  INA181A2IDBVR  [SOT-23-6_L2.9-W1.6-P0.95-LS2.8-BL]  25.4 92.58 90 top
U10  INA181A2IDBVR  [SOT-23-6_L2.9-W1.6-P0.95-LS2.8-BL]  25.65 81.53 90 top
U11  INA181A2IDBVR  [SOT-23-6_L2.9-W1.6-P0.95-LS2.8-BL]  25.65 68.58 90 top
U12  INA181A2IDBVR  [SOT-23-6_L2.9-W1.6-P0.95-LS2.8-BL]  25.78 55.63 90 top
USB1  MICRO USB  [USB-MICRO_B]  36.45 97.28 180 top

## Footprints (pads in the part's own frame, mm; a bottom-side part is the same pattern mirrored in y, then rotated)
C0603
  rect 0.8x0.9 smd: 1(-0.7,0) 2(0.7,0)
CAP-SMD_L3.2-W1.6
  rect 1.2x1.4 smd: 1(-1.35,0) 2(1.35,0)
CAP-T-10*10.5
  rect 3.2x1.2 smd: 1(-4.5,0) 2(4.5,0)
CONN-TH_5557-2-4P
  round 2.8 hole 1.9: 1(-6.3,2.1) 2(-2.1,2.1) 3(2.1,2.1) 4(6.3,2.1) 5(6.3,-2.1) 6(2.1,-2.1) 7(-2.1,-2.1) 8(-6.3,-2.1)
CONN-TH_5557-2X3A
  rect 2.6x2.6 hole 1.8: 1(4.2,-2.1)
  round 2.6 hole 1.8: 2(0,-2.1) 3(-4.2,-2.1) 4(4.2,2.1) 5(0,2.1) 6(-4.2,2.1)
CONN-TH_WJ126V-5.0-2P
  round 2 hole 1.3: 1(0,2.501) 2(0,-2.501)
HDR-TH_3P-P2.54-V-M
  rect 1.7x1.7 hole 1.1: 1(-2.54,0)
  round 1.7 hole 1.1: 2(0,0) 3(2.54,0)
HDR-TH_5P-P2.54-V-M
  rect 1.7x1.7 hole 1.1: 1(-5.08,0)
  round 1.7 hole 1.1: 2(-2.54,0) 3(0,0) 4(2.54,0) 5(5.08,0)
LED 0805B
  rect 1.524x1.27 smd: 1(-1.27,0)
  custom 1.427x1.173 smd rot 140: 2(1.27,0)
LED 0805Y
  rect 1.524x1.27 smd: 1(-1.27,0)
  custom 1.427x1.173 smd rot 60: 2(1.27,0)
LED_0805
  rect 1x1.25 smd: 1(-1.15,0.005) 2(1.05,0.005)
M2螺丝
  round 2 hole 2: 1(0,0)
Pad_e60
  oval 5x2.5 hole 1.5: 1(0,0)
Pad_e72
  oval 5x2.5 hole 1.5: 1(0,0)
QFN-24_L4.0-W4.0-P0.50-BL-EP2.6
  rect 0.28x0.665 smd: 1(-1.25,-1.907) 2(-0.75,-1.907) 3(-0.25,-1.907) 4(0.25,-1.907) 5(0.75,-1.907) 6(1.25,-1.907) 13(1.25,1.907) 14(0.75,1.907) 15(0.25,1.907) 16(-0.25,1.907) 17(-0.75,1.907) 18(-1.25,1.907)
  rect 0.665x0.28 smd: 7(1.907,-1.25) 8(1.907,-0.75) 9(1.907,-0.25) 10(1.907,0.25) 11(1.907,0.75) 12(1.907,1.25) 19(-1.907,1.25) 20(-1.907,0.75) 21(-1.907,0.25) 22(-1.907,-0.25) 23(-1.907,-0.75) 24(-1.907,-1.25)
  rect 2.55x2.55 smd: 25(0,0)
R0603
  rect 0.806x0.864 smd: 1(-0.753,0) 2(0.753,0)
R2512
  rect 1.282x3.456 smd: 1(-3.067,0) 2(3.067,0)
R 0603_L
  rect 0.762x0.762 smd: 1(-0.65,0) 2(0.65,0)
RELAY-TH_SRD-XXVDC-XL-C
  round 2.794 hole 1.524: 1(-5.1,-6) 2(7.1,-6) 3(7.1,6) 4(-5.1,6) 5(-7.1,0)
S8050_SOT-23
  rect 1x0.8 smd: 1(1.15,-0.823) 2(1.15,1.077) 3(-1.15,0.127)
SMA_L4.3-W2.7-LS5.1-RD
  rect 2.1x1.8 smd: 1(-2.4,0) 2(2.4,0)
SOIC-20_L13.0-W7.6-P1.27-LS10.6-BL
  oval 0.6x2.3 smd: 1(-5.715,-4.7) 2(-4.445,-4.7) 3(-3.175,-4.7) 4(-1.905,-4.7) 5(-0.635,-4.7) 6(0.635,-4.7) 7(1.905,-4.7) 8(3.175,-4.7) 9(4.445,-4.7) 10(5.715,-4.7) 11(5.715,4.7) 12(4.445,4.7) 13(3.175,4.7) 14(1.905,4.7) 15(0.635,4.7) 16(-0.635,4.7) 17(-1.905,4.7) 18(-3.175,4.7) 19(-4.445,4.7) 20(-5.715,4.7)
SOP16_L
  custom 1.5x0.5 smd: 1(-2.752,4.445)
  custom 1.499x0.5 smd: 2(-2.752,3.175) 3(-2.752,1.905) 4(-2.752,0.635) 5(-2.752,-0.635) 6(-2.752,-1.905) 7(-2.752,-3.175) 8(-2.752,-4.445) 9(2.752,-4.445) 10(2.752,-3.175) 11(2.752,-1.905) 12(2.752,-0.635) 13(2.752,0.635) 14(2.752,1.905) 15(2.752,3.175) 16(2.752,4.445)
SOT-23-6_L2.9-W1.6-P0.95-LS2.8-BL
  rect 0.532x1.072 smd: 1(-0.95,-1.149) 2(0,-1.149) 3(0.95,-1.149) 4(0.95,1.149) 5(0,1.149) 6(-0.95,1.149)
SOT-223-3_L6.5-W3.4-P2.30-LS7.0-BR
  rect 2.5x1.1 smd: 1(2.97,-2.3) 2(2.97,0) 3(2.97,2.3)
  rect 2.34x3.6 smd: 4(-2.97,0)
TSW SMD-3*6*2.5
  rect 2x1.5 smd: 1(-3.995,-0.02) 2(3.937,0)
USB-MICRO_B
  round 0.35 hole 0.55x0.555: 0(2,2.295) 8(-2,2.295)
  custom 0.394x2.5 smd: 1(-1.295,3.217) 2(-0.647,3.217) 3(0,3.217) 4(0.647,3.217) 5(1.296,3.217)
  custom 1.5x1 smd: 6(3.2,2.5) 7(-3.2,2.5)
  round 1.5 hole 1x2: 9(-2.825,-0.005) 10(2.825,-0.005)
WIRELM-SMD_ESP32-S3-WROOM-1
  rect 1.5x0.9 smd: 1(-8.75,8.895) 2(-8.75,7.625) 3(-8.75,6.355) 4(-8.75,5.085) 5(-8.75,3.815) 6(-8.75,2.545) 7(-8.75,1.275) 8(-8.75,0.005) 9(-8.75,-1.265) 10(-8.75,-2.535) 11(-8.75,-3.805) 12(-8.75,-5.075) 13(-8.75,-6.345) 14(-8.75,-7.615) 27(8.75,-7.615) 28(8.75,-6.345) 29(8.75,-5.075) 30(8.75,-3.805) 31(8.75,-2.535) 32(8.75,-1.265) 33(8.75,0.005) 34(8.75,1.275) 35(8.75,2.545) 36(8.75,3.815) 37(8.75,5.085) 38(8.75,6.355) 39(8.75,7.625) 40(8.75,8.895)
  rect 0.9x1.5 smd: 15(-6.985,-8.895) 16(-5.715,-8.895) 17(-4.445,-8.895) 18(-3.175,-8.895) 19(-1.905,-8.895) 20(-0.635,-8.895) 21(0.635,-8.895) 22(1.905,-8.895) 23(3.175,-8.895) 24(4.445,-8.895) 25(5.715,-8.895) 26(6.985,-8.865)
  rect 0.9x0.9 smd: 41(-2.9,2.575) 41(-2.9,1.175) 41(-2.9,-0.225) 41(-1.5,2.575) 41(-1.5,1.175) 41(-1.5,-0.225) 41(-0.1,2.575) 41(-0.1,1.175) 41(-0.1,-0.225)

## Nets
As in the schematic, except:
+5V: C4.2 C5.2 C28.1 C29.1 D1.1 H5.2 NOREF.1 U2.3 U5.20 U6.20 U7.4
GND: C1.1 C2.1 C3.1 C4.1 C5.1 C6.1 C7.1 C12.2 C13.1 C14.1 C15.2 C20.2 C21.2 C22.2 C23.2 C24.2 C25.2 C26.2 C27.2 C28.2 C29.2 C30.2 C31.1 C32.1 C33.2 C34.2 C35.2 C36.2 C37.2 H5.5 L1.3 L1.6 L2.3 L2.6 L3.3 L3.6 L4.3 L4.6 LED5.1 M1.6 M2.6 M3.6 M4.6 NOREF#2.1 P1.2 Q5.2 R9.1 R11.2 R13.2 R15.2 R17.2 R19.2 R22.1 SW1.1 SW2.1 U1.1 U1.40 U1.41 U2.1 U3.1 U5.1 U5.10 U5.19 U6.1 U6.10 U6.19 U7.5 U7.6 U7.7 U8.1 U8.11 U8.18 U8.25 U9.2 U9.5 U10.2 U10.5 U11.2 U11.5 U12.2 U12.5 USB1.5

Pads without a net: M1 2; M2 2; M3 2; M4 2; SCREW3 1; SCREW3#2 1; SCREW4 1; SCREW4#2 1; U1 12 15 16 28 29 30; U3 7 8 9 10 11 12 15; U8 2 3 4 5 6 7 12 14 15 16 17 19 21 22; USB1 0 4 6 7 8 9 10

## Via types
v1: diameter 0.61, hole 0.305, Top Layer to Bottom Layer, 475 vias

## Routing (per net, layer and track width the routed paths; a pad name or vN(x,y) marks a point on that pad's centre or on a via; arc(x,y) is an arc through that point)
3V3: length 217.1
  Top Layer w0.203: U8.8 53.2,57.13 53.6,57.53 57.15,57.53 57.53,57.91 57.53,61.85 56.77,62.61 51.43,62.61 R21.2
  Top Layer w0.381: U2.4 43.99,69.99 C33.1 47.69,64.2 48.51,63.37 ; U2.4 43.95,70.7 R8.2 42.16,66.04 41.78,65.66 36.45,65.66 35.81,66.29 35.81,69.07 37.1,70.36 37.67,70.36 37.92,70.6 ; U2.4 43.99,71.42 45.34,72.77 45.34,74.42 ; 37.92,70.6 U2.2 ; 37.92,70.6 R3.1 ; 48.51,63.37 50.66,63.37 R21.2 ; 48.51,63.37 46.61,61.47 R41.2 45.84,61.08 45.47,60.71 45.47,46.86 44.96,46.36 ; 44.96,46.36 45.97,45.34 v1(47.5,45.34) ; 44.96,46.36 26.29,46.36 24.7,47.94 24.7,54.61 U12.6 25.41,54.68 25.78,55.05 25.78,61.85 24.51,63.12 24.51,64.71 C36.1 24.57,67.56 U11.6 25.28,67.63 25.65,68 25.65,74.93 24.38,76.2 24.38,78.42 C35.1 24.45,80.53 U10.6 25.28,80.58 25.65,80.96 25.65,86.61 24.19,88.08 C34.1 24.25,89.72 U9.6 ; 41.66,78.66 41.66,77.34 ; 41.66,77.34 41.15,76.84 37.85,76.84 37.21,77.47 37.21,80.14 37.85,80.77 U3.4 37.85,85.79 40,87.94 40,89.41 41.28,90.68 41.28,96.2 C1.2 C2.2 44.63,97.65 R2.2 48.53,97.65 48.77,97.41 U1.2 ; 41.66,77.34 42.86,76.14 C12.1 44.45,75.31 45.34,74.42 ; R7.2 46.35,79 46.35,75.44 45.34,74.42
  Bottom Layer w0.381: H5.1 65.79,41.66 56.52,41.66 55.5,42.67 55.5,44.58 54.74,45.34 v1(47.5,45.34)
7.4VDC: length 227.3
  Top Layer w0.381: U10.3 26.8,85.73 27.69,86.61 R38.2 ; U9.3 26.55,96.4 27.43,97.28 R37.2 ; R39.2 27.56,73.53 26.42,72.4 26.42,69.91 U11.3 ; U12.3 26.93,59.57 27.69,60.33 28.59,60.33
  Top Layer w1.524: v1(29.66,90.98) v1(28.9,90.98) v1(28.13,90.98) ; v1(29.66,90.98) 29.91,90.98 30.99,92.06 30.99,96.03 29.74,97.28 R37.2 ; v1(29.66,90.98) 29.66,87.55 R38.2 28.85,86.49 28.85,73.79 R39.2 28.85,73.28 28.85,60.58 R40.2
  Top Layer w3.048: L4.5 11.56,40.89 18.03,34.42 23.11,34.42 27.94,29.59 v1(28.83,29.59) v1(29.59,29.59)
  Bottom Layer w3.048: 14.06,29.56 14.1,29.59 v1(27.31,29.59) ; 14.06,29.56 v1(27.31,29.59) ; 14.06,29.56 U7.2 U7.3 ; 19.43,60.83 19.43,73.15 ; 19.43,60.83 18.29,61.98 14.73,61.98 11.56,65.15 L3.5 ; 19.43,60.83 19.43,50.42 17.02,48.01 12.93,48.01 11.56,49.38 L4.5 ; 19.43,73.15 17.53,75.06 13.59,75.06 11.56,77.09 L2.5 ; 19.43,73.15 19.43,85.85 17.02,88.27 ; 11.56,91.75 11.56,89.66 12.95,88.27 17.02,88.27 ; 17.02,88.27 19.69,90.93 28.7,90.93 ; v1(27.31,29.59) v1(28.07,29.59) v1(28.83,29.59) v1(29.59,29.59) v1(30.35,29.59)
  vias: v1(27.31,30.35) v1(27.31,28.83) v1(28.07,30.35) v1(28.07,28.83) v1(28.83,30.35) v1(28.83,28.83) v1(29.59,30.35) v1(29.59,28.83) v1(30.35,30.35) v1(30.35,28.83)
12.6VDC: length 133.3
  Top Layer w0.203: J2.5 68.06,38.09 v1(70.49,40.51) ; R10.1 74.68,90.43 v1(74.68,90.42) ; v1(70.61,64.39) 71.55,65.32 71.55,67.61 72.26,68.33 v1(72.26,76.33)
  Top Layer w3.048: C25.1 v1(18.92,38.66) 18.92,38.61 19.43,38.1 C24.1
  Bottom Layer w0.203: v1(70.49,40.51) 71.25,41.28 71.25,61.72 70.61,62.36 v1(70.61,64.39) ; v1(74.68,90.42) 75.69,89.41 75.69,81.66 72.26,78.23 v1(72.26,76.33)
  Bottom Layer w3.048: 8.57,32.46 U7.1 20.18,39.88 v1(38.71,39.88) v1(39.47,39.88) v1(40.23,39.88) v1(41,39.88) v1(41.76,39.88) 55.23,39.88 J2.1 63.02,36.09 J2.5
  vias: v1(17.77,38.64) v1(18.29,38.03) v1(18.41,39.27) v1(18.88,37.52) v1(19.04,39.91) v1(19.51,38.16) v1(19.56,39.3) v1(20.14,38.79)
+5V: length 212.7
  Top Layer w0.381: 32,75.18 v1(32.55,75.18) v1(33.31,75.18) v1(34.08,75.18) v1(34.84,75.18) ; 32,75.18 30.99,76.2 30.99,87.36 D1.1 ; 32,75.18 32,74.04 30.99,73.03 30.99,64.15 32,63.13 41.52,63.13 42.67,61.98 42.67,59.82 U5.20 ; U6.20 57.02,42.04 64.77,42.04 65.15,42.42 H5.2
  Top Layer w1.27: U2.3 39.99,68.44 40.77,69.22 40.77,73.53 39.12,75.18 v1(34.84,75.18)
  Bottom Layer w0.381: H5.2 65.15,45.26 64.1,46.32 25.24,46.32 22.61,43.69 21.59,43.69 ; 20.19,43.94 20.45,43.69 21.59,43.69 ; 21.59,43.69 v1(20.19,45.08)
  Bottom Layer w1.27: 34.8,75.18 v1(34.08,75.18) v1(33.31,75.18) v1(32.55,75.18) 32,75.18 30.73,73.91 30.73,52.2 28.57,50.04 22.86,50.04 v1(20.19,47.37) v1(20.19,46.61) v1(20.19,45.84) v1(20.19,45.08) 20.19,43.94 11.81,35.56 6.86,35.56 5.46,34.16 5.46,17.91
  Bottom Layer w3.048: U7.4 12.77,18.54 10.87,16.64 4.32,16.64 NOREF.1
GND:
  vias: v1(0.76,37.47) v1(0.76,36.7) v1(0.76,35.94) v1(0.76,35.18) v1(0.76,34.42) v1(1.52,37.47) v1(1.52,36.7) v1(1.52,35.94) v1(1.52,35.18) v1(1.52,34.42) v1(2.27,37.47) v1(2.27,36.7) v1(2.27,35.94) v1(2.27,35.18) v1(2.27,34.42) v1(3.05,37.47) v1(3.05,36.7) v1(3.05,35.94) v1(3.05,35.18) v1(3.05,34.42) v1(5.59,62.48) v1(5.59,61.72) v1(6.35,62.48) v1(6.35,61.72) v1(6.35,60.96) v1(6.48,6.86) v1(6.48,6.1) v1(6.48,5.33) v1(6.48,4.57) v1(6.48,3.81) v1(6.6,89.41) v1(6.6,88.65) v1(6.6,87.88) v1(6.6,87.12) v1(6.6,86.36) v1(6.6,76.71) v1(6.6,75.95) v1(6.6,75.18) v1(6.6,74.42) v1(6.6,73.66) v1(7.11,62.48) v1(7.11,61.72) v1(7.11,60.96) v1(7.11,60.2) v1(7.24,6.86) v1(7.24,6.1) v1(7.24,5.33) v1(7.24,4.57) v1(7.24,3.81) v1(7.37,89.41) v1(7.37,88.65) v1(7.37,87.88) v1(7.37,87.12) v1(7.37,86.36) v1(7.37,76.71) v1(7.37,75.95) v1(7.37,75.18) v1(7.37,74.42) v1(7.37,73.66) v1(7.87,62.48) v1(7.87,61.72) v1(7.87,60.96) v1(7.87,60.2) v1(8,6.86) v1(8,6.1) v1(8,5.33) v1(8,4.57) v1(8,3.81) v1(8.13,89.41) v1(8.13,88.65) v1(8.13,87.88) v1(8.13,87.12) v1(8.13,86.36) v1(8.13,76.71) v1(8.13,75.95) v1(8.13,75.18) v1(8.13,74.42) v1(8.13,73.66) v1(8.64,62.48) v1(8.64,61.72) v1(8.64,60.96) v1(8.64,60.2) v1(19.56,93.22) v1(19.81,6.22) v1(19.81,5.46) v1(19.81,4.7) v1(20.32,93.22) v1(20.57,6.22) v1(20.57,5.46) v1(20.57,4.7) v1(21.08,93.22) v1(21.34,6.22) v1(21.34,5.46) v1(21.34,4.7) v1(21.84,93.22) v1(22.1,6.22) v1(22.1,5.46) v1(22.1,4.7) v1(22.46,81.81) v1(22.46,81.05) v1(22.46,80.29) v1(22.46,79.52) v1(22.46,78.76) v1(22.48,68.33) v1(22.48,67.56) v1(22.48,66.8) v1(22.48,66.04) v1(22.48,65.28) v1(22.48,55.12) v1(22.48,54.36) v1(22.48,53.59) v1(22.48,52.83) v1(22.48,52.07) v1(22.61,93.22) v1(22.86,6.22) v1(22.86,5.46) v1(22.86,4.7) v1(23.88,99.34) v1(23.88,98.58) v1(24.64,99.34) v1(24.64,98.58) v1(25.15,79.76) v1(25.15,77.34) v1(25.21,63.63) v1(25.4,99.34) v1(25.4,98.58) v1(25.91,79.76) v1(25.91,77.34) v1(25.97,63.63) v1(25.97,62.86) v1(26.16,99.34) v1(26.16,98.58) v1(26.92,99.34) v1(26.92,98.58) v1(27.18,71.12) v1(27.18,71.12) v1(27.18,70.36) v1(27.29,24.77) v1(27.29,24) v1(27.47,83.29) v1(28.05,24.77) v1(28.05,24) v1(28.19,88.9) v1(28.3,93.2) v1(28.81,24.77) v1(28.81,24) v1(29.34,57.91) v1(29.34,57.15) v1(29.57,24.77) v1(29.57,24) v1(30.23,78.99) v1(30.23,78.23) v1(30.23,77.47) v1(30.23,76.71) v1(30.23,75.95) v1(30.34,24.77) v1(30.34,24) v1(30.61,44.32) v1(31.37,44.32) v1(32.13,76.71) v1(32.13,44.32) v1(32.89,76.71) v1(32.89,44.32) v1(33.66,76.71) v1(33.66,44.32) v1(34.04,6.22) v1(34.04,5.46) v1(34.04,4.7) v1(34.29,87.38) v1(34.29,86.61) v1(34.29,85.85) v1(34.42,76.71) v1(34.8,6.22) v1(34.8,5.46) v1(34.8,4.7) v1(35.18,76.71) v1(35.56,6.22) v1(35.56,5.46) v1(35.56,4.7) v1(36.07,48.4) v1(36.32,6.22) v1(36.32,5.46) v1(36.32,4.7) v1(36.83,48.4) v1(37.08,6.22) v1(37.08,5.46) v1(37.08,4.7) v1(37.59,48.4) v1(38.35,48.4) v1(39.12,48.4) v1(42.16,93.47) v1(42.93,93.47) v1(43.69,93.47) v1(44.32,99.19) v1(44.45,93.47) v1(45.09,99.19) v1(45.21,93.47) v1(45.85,99.19) v1(46.61,99.19) v1(47.37,99.19) v1(48.13,95) v1(48.51,6.22) v1(48.51,5.46) v1(48.51,4.7) v1(48.9,95) v1(49.28,6.22) v1(49.28,5.46) v1(49.28,4.7) v1(49.78,74.42) v1(50.04,6.22) v1(50.04,5.46) v1(50.04,4.7) v1(50.29,58.29) v1(50.29,57.53) v1(50.29,56.77) v1(50.8,6.22) v1(50.8,5.46) v1(50.8,4.7) v1(51.05,58.29) v1(51.05,57.53) v1(51.56,6.22) v1(51.56,5.46) v1(51.56,4.7) v1(51.69,55.5) v1(51.69,54.74) v1(51.69,53.98) v1(52.45,55.5) v1(52.45,54.74) v1(52.45,53.98) v1(52.58,82.8) v1(53.21,55.5) v1(53.21,54.74) v1(53.21,53.98) v1(53.32,82.81) v1(53.47,84.45) v1(53.72,99.19) v1(54.23,84.45) v1(54.36,78.99) v1(54.36,78.23) v1(54.36,77.47) v1(54.48,99.19) v1(54.48,60.96) v1(54.48,60.2) v1(54.48,59.44) v1(54.86,25.91) v1(54.86,25.15) v1(54.86,24.38) v1(54.86,23.62) v1(54.86,22.86) v1(55.25,99.19) v1(55.63,25.91) v1(55.63,25.15) v1(55.63,24.38) v1(55.63,23.62) v1(55.63,22.86) v1(55.88,82.17) v1(56.01,99.19) v1(56.26,85.47) v1(56.64,10.54) v1(56.64,9.78) v1(56.77,99.19) v1(57.28,86.36) v1(59.94,87.12) v1(59.94,85.47) v1(60.96,45.09) v1(60.96,10.54) v1(60.96,9.78) v1(61.34,42.8) v1(61.72,45.09) v1(62.23,75.31) v1(62.23,74.55) v1(62.23,73.79) v1(62.23,73.03) v1(62.23,72.26) v1(64.52,77.85) v1(64.77,40.26) v1(65.53,40.26) v1(65.72,94.23) v1(65.66,86.49) v1(65.66,85.73) v1(65.66,84.96) v1(65.66,84.2) v1(65.66,83.44) v1(65.91,79.63) v1(66.29,40.26) v1(66.55,94.23) v1(66.55,59.18) v1(66.55,56.13) v1(66.93,75.44) v1(66.93,74.68) v1(67.06,40.26) v1(67.69,75.44) v1(67.69,74.68) v1(67.82,40.26) v1(68.45,75.44) v1(68.45,74.68) v1(68.89,56.13) v1(68.96,53.09) v1(69.22,75.44) v1(69.22,74.68) v1(69.47,47.24) v1(69.85,82.42) v1(69.85,81.66) v1(69.85,80.9) v1(69.85,80.14) v1(69.85,79.38) v1(69.98,75.44) v1(69.98,74.68) v1(70.49,60.33) v1(70.49,59.56) v1(70.49,58.8) v1(70.49,58.04) v1(70.49,57.28) v1(70.61,82.42) v1(70.61,81.66) v1(70.61,80.9) v1(70.61,80.14) v1(70.61,79.38) v1(70.61,42.8) v1(72.26,87.88) v1(72.52,67.56) v1(73.03,87.5) v1(74.55,53.34) v1(74.55,52.58) v1(74.55,51.82) v1(74.55,51.05) v1(74.55,50.29) v1(75.06,21.08) v1(75.06,20.32) v1(75.06,19.56) v1(75.06,18.8) v1(75.06,18.03) v1(75.82,21.08) v1(75.82,20.32) v1(75.82,19.56) v1(75.82,18.8) v1(75.82,18.03) v1(76.07,75.95) v1(76.07,75.18) v1(76.07,74.42) v1(76.07,73.66) v1(76.07,72.9)
VBATT: length 7.2
  Top Layer w0.381: U1.38 70.8,96.14 C15.1 R11.1 R10.2
(no net):
  vias: v1(30.61,45.09) v1(31.37,45.09) v1(32.13,45.09) v1(32.89,45.09) v1(33.66,45.09)
BRAKE: length 46.5
  Top Layer w0.203: v1(73.28,61.47) 72.75,60.93 72.75,44.29 72.83,44.2 ; v1(65.79,76.33) 63.88,76.33 62.74,77.47 U1.23
  Bottom Layer w0.203: v1(73.28,61.47) 73.28,64.9 74.88,66.5 74.88,71.88 70.44,76.33 v1(65.79,76.33)
CHIP_PU: length 41.2
  Top Layer w0.203: SW1.2 60.67,72.74 C13.2 60.71,72.83 60.71,74.68 59.94,75.44 Q1.3 53.35,77.72 v1(52.71,78.36) 51.82,79.25 51.82,80.8 51.29,81.33 50.09,81.33 48.77,82.66 48.77,91.76 C3.2
  Top Layer w0.381: C3.2 R2.1 47.75,96.15 47.75,96.14 U1.3
D+: length 10
  Top Layer w0.203: 36.58,84.16 36.58,87.08 36.45,87.21 USB1.3
D-: length 10.6
  Top Layer w0.203: U3.6 v1(35.31,86.23) ; v1(37.08,91.57) 37.08,94.05 USB1.2
  Bottom Layer w0.203: v1(35.31,86.23) 35.31,89.79 v1(37.08,91.57)
DIR1: length 70.5
  Top Layer w0.203: U1.25 65.28,78.36 66.17,77.47 72.59,77.47 73.61,76.45 73.61,65.28 70.36,62.03 62.99,62.03 59.38,58.42 59.38,57.78 57.1,55.5 57.1,47.62 56.64,47.17 53.21,47.17 49.48,43.43 49.48,38.94 48.51,37.97 U6.2
DIR2: length 76.5
  Top Layer w0.203: U6.4 47.75,35.43 49.78,37.47 49.78,43.31 53.34,46.86 56.77,46.86 57.4,47.5 57.4,55.37 59.69,57.66 59.69,58.29 63.12,61.72 70.49,61.72 73.91,65.15 73.91,85.47 72.39,87 69.97,87 69.71,87.25 U1.31
DIR3: length 82
  Top Layer w0.203: U1.33 69.58,89.79 69.84,89.53 72.39,89.53 74.22,87.71 74.22,65.02 70.61,61.42 63.25,61.42 60,58.17 60,57.53 57.71,55.25 57.71,47.37 56.9,46.56 53.47,46.56 50.09,43.18 50.09,37.34 49.15,36.4 49.15,33.91 48.13,32.89 U6.6
DIR4: length 86.8
  Top Layer w0.203: U1.35 69.59,92.33 70.23,91.69 70.23,90.47 70.87,89.84 72.52,89.84 74.52,87.83 74.52,64.9 70.74,61.11 63.37,61.11 60.3,58.04 60.3,57.41 58.01,55.12 58.01,47.25 57.02,46.25 53.59,46.25 50.39,43.05 50.39,37.21 49.45,36.27 49.45,33.78 49.28,33.61 49.28,31.5 48.13,30.35 U6.8
DTR: length 30.8
  Top Layer w0.203: R4.1 47.5,70.36 48.26,69.6 50.98,69.6 Q2.2 52.37,70.99 52.37,77.13 48.73,80.77 38.74,80.77 37.85,79.88 37.85,78.66
ESC1: length 80.7
  Top Layer w0.203: U1.24 v1(64.01,79.5) ; U6.11 72.9,27.81 75.82,30.73 75.82,64.9 v1(75.95,65.02)
  Bottom Layer w0.203: v1(64.01,79.5) 64.01,78.99 64.21,78.79 66.8,78.79 67.56,78.03 69.6,78.03 75.49,72.14 75.49,65.48 v1(75.95,65.02)
ESC2: length 75.6
  Top Layer w0.203: 66.55,80.92 v1(66.55,78.23) ; U6.13 73.15,30.35 75.51,32.72 75.51,62.15 75.18,62.48 v1(75.18,63.75)
  Bottom Layer w0.203: v1(75.18,63.75) 75.18,72.01 69.47,77.72 67.06,77.72 v1(66.55,78.23)
ESC3: length 78.5
  Top Layer w0.203: v1(74.68,88.9) 75.13,88.44 75.13,64.65 72.44,61.95 72.44,47.63 69.77,44.96 69.77,42.55 68.33,41.1 58.04,41.1 56.82,39.88 56.82,36.24 56.64,36.06 56.64,33.95 55.58,32.89 U6.15 ; U1.32 69.58,88.52 69.84,88.27 v1(70.61,88.27)
  Bottom Layer w0.203: v1(70.61,88.27) 71.37,89.03 74.55,89.03 v1(74.68,88.9)
ESC4: length 75.7
  Top Layer w0.203: U1.34 68.32,91.06 v1(69.6,91.06) ; v1(71.37,90.55) 71.4,90.53 72.26,90.53 74.83,87.96 74.83,64.77 72.14,62.08 72.14,47.75 69.47,45.09 69.47,42.67 68.2,41.4 57.91,41.4 56.52,40.01 56.52,36.37 55.58,35.43 U6.17
  Bottom Layer w0.203: v1(71.37,90.55) 70.87,91.06 v1(69.6,91.06)
FBM1: length 100.6
  Top Layer w0.203: R13.1 R12.2 21.21,13.33 v1(21.21,11.94)
  Bottom Layer w0.203: H1.3 70.36,56.13 70.36,53.52 70.54,53.34 70.54,50.85 70.84,50.54 70.84,46.86 69.75,45.77 69.75,38.08 67.68,36 67.68,19.27 66.52,18.11 66.52,15.72 62.1,11.3 62.1,9.65 60.38,7.93 22.17,7.93 21.21,8.89 v1(21.21,11.94)
FBM2: length 76.7
  Top Layer w0.203: R15.1 R14.2 35.56,13.33 v1(35.56,12.32)
  Bottom Layer w0.203: v1(35.56,12.32) 35.94,11.94 47.12,11.94 47.55,11.51 61.85,11.51 66.22,15.88 66.22,18.24 67.37,19.39 67.37,36.13 69.44,38.2 69.44,45.9 70.54,46.99 70.54,50.42 70.23,50.72 70.23,53.21 H2.3
FBM3: length 59
  Top Layer w0.203: v1(50.16,12.45) 50.16,13.96 R16.2 50.16,14.01 R17.1
  Bottom Layer w0.203: v1(50.16,12.45) 50.8,11.81 61.72,11.81 65.91,16 65.91,18.37 67.07,19.52 67.07,36.28 69.1,38.31 69.1,45.99 70.23,47.12 70.23,50.29 H3.3
FBM4: length 36.2
  Top Layer w0.203: v1(64.64,17.53) 64.64,15.88 R19.1 R18.2
  Bottom Layer w0.203: v1(64.64,17.53) 66.76,19.65 66.76,36.41 68.8,38.44 68.8,48.6 H4.3
GPIO0: length 55.9
  Top Layer w0.203: Q2.3 53.34,70.61 53.34,68.71 55.12,66.93 67.44,66.93 68.55,65.82 SW2.2 70.83,63.59 72.14,64.9 72.14,66.1 C14.2 73.3,67.27 73.3,76.33 72.53,77.1 64.12,77.1 63.37,77.85 63.37,78.36 ; U1.27 66.92,82.17 66.68,82.41 64.41,82.41 v1(64.39,82.42)
  Bottom Layer w0.203: v1(63.37,78.61) 63.37,81.41 v1(64.39,82.42)
H1: length 47.2
  Top Layer w0.203: 32.89,58.17 35.43,58.17 38.84,61.57 39.3,61.57 40.41,60.45 v1(41.66,60.45) ; v1(56.52,82.93) 55.63,82.93 55.12,82.42 U1.17
  Bottom Layer w0.203: v1(56.52,82.93) 56.97,82.47 56.97,68.2 53.72,64.95 50.55,64.95 46.05,60.45 v1(41.66,60.45)
H1CS: length 85.6
  Top Layer w0.203: v1(30.48,48.26) 29.97,48.77 29.97,53.77 29.26,54.48 v1(29.26,54.99) ; U9.1 26.55,88.52 v1(27.18,87.89) 27.18,87.88
  Bottom Layer w0.203: v1(30.48,48.26) 31.12,47.62 55.63,47.62 58.67,50.67 58.67,55.63 60.58,57.53 63.63,57.53 H1.1 ; v1(29.26,54.99) 29.26,56.01 28.63,56.64 28.63,76.33 28.32,76.63 28.32,83.69 27.18,84.84 v1(27.18,87.89)
H2: length 52
  Top Layer w0.203: v1(41.53,61.85) 40,61.85 39.68,62.18 38.58,62.18 37.54,61.14 31.75,61.14 30.68,60.07 30.68,53.94 31.54,53.09 32.89,53.09 ; v1(55.88,77.85) 56.26,78.23 57.15,78.23 57.66,78.74 U1.19
  Bottom Layer w0.203: v1(41.53,61.85) 46.59,61.85 50.29,65.56 53.47,65.56 56.36,68.45 56.36,76.61 55.88,77.09 v1(55.88,77.85)
H2CS: length 73.1
  Top Layer w0.203: v1(29.59,48.01) 29.59,53.21 v1(29.21,53.59) ; v1(27.31,77.22) 27.31,79.12 26.8,79.62 U10.1
  Bottom Layer w0.203: v1(27.31,77.22) 27.86,76.66 27.86,54.86 29.02,53.7 29.1,53.7 v1(29.21,53.59) ; H2.1 59.82,54.61 58.98,53.77 58.98,50.55 55.75,47.32 30.28,47.32 v1(29.59,48.01)
H3: length 49.6
  Top Layer w0.203: U1.21 60.2,83.57 v1(59.94,83.82)
  Top Layer w0.381: U5.11 43.56,48.01 44.32,48.77 v1(44.32,49.53)
  Bottom Layer w0.203: v1(59.94,83.82) 59.74,84.03 58.98,84.03 58.19,83.24 58.19,67.69 54.23,63.73 51.05,63.73 45.49,58.17 45.49,54.92 45.17,54.6 45.17,52.87 44.88,52.58 44.88,51.11 44.32,50.55 v1(44.32,49.53)
H3CS: length 58.4
  Top Layer w0.203: v1(28.83,47.62) v1(28.83,52.32) ; v1(27.31,63.75) 27.31,66.29 26.8,66.8 U11.1
  Bottom Layer w0.203: v1(28.83,52.32) 28.83,53.18 27.31,54.71 v1(27.31,63.75) ; v1(28.83,47.62) 29.44,47.02 55.88,47.02 59.28,50.42 59.28,51.03 59.88,51.63 H3.1
H4: length 53.4
  Top Layer w0.203: U1.8 51.75,89.79 53.28,88.27 58.17,88.27 58.55,87.88 58.83,87.88 59.18,87.54 v1(59.18,87.25)
  Top Layer w0.381: U5.15 43.56,53.09 44.32,53.85 v1(44.32,54.86)
  Bottom Layer w0.203: v1(59.18,87.25) 59.18,85.22 57.58,83.62 57.58,67.95 53.97,64.34 50.8,64.34 44.88,58.42 44.88,55.42 v1(44.32,54.86)
H4CS: length 44.6
  Top Layer w0.203: U12.1 27.94,53.67 v1(27.94,47.62)
  Bottom Layer w0.203: H4.1 63.75,48.77 58.06,48.77 56,46.71 28.85,46.71 v1(27.94,47.62)
HAM1: length 69.6
  Top Layer w0.203: U5.18 40.13,56.9 39.12,55.88 v1(37.08,55.88)
  Bottom Layer w0.203: v1(37.08,55.88) 36.78,56.19 36.78,79.05 31.37,84.45 31.37,91.69 28.7,94.36 8.95,94.36 L1.1
HAM2: length 90.2
  Top Layer w0.203: U5.14 39.1,51.82 38.1,52.81 v1(38.1,52.96)
  Bottom Layer w0.203: 7.36,83.76 5.21,85.91 5.21,97.54 5.72,98.04 17.78,98.04 21.16,94.67 28.83,94.67 31.67,91.82 31.67,84.58 37.08,79.17 37.08,57.35 38.1,56.34 v1(38.1,52.96)
HAM3: length 109.3
  Top Layer w0.203: v1(38.74,57.15) 38.1,56.52 36.58,56.52 35.81,55.75 35.81,50.04 35.05,49.28 32.89,49.28
  Bottom Layer w0.203: L3.1 4.6,73.19 4.6,97.79 5.46,98.65 18.03,98.65 21.41,95.28 29.08,95.28 32.28,92.07 32.28,84.83 37.69,79.42 37.69,58.67 38.74,57.63 v1(38.74,57.15)
HAM4: length 119.6
  Top Layer w0.203: v1(38.74,59.56) 37.34,58.17 37.34,57.53 36.93,57.12 36.32,57.12 35.2,56.01 35.2,54.74 34.82,54.36 32.89,54.36 ; v1(4.57,61.47) 7.36,58.68 L4.1
  Bottom Layer w0.203: v1(4.57,61.47) 3.99,62.05 3.99,98.04 5.21,99.26 18.28,99.26 21.66,95.89 29.33,95.89 32.89,92.33 32.89,85.09 38.3,79.68 38.3,60 v1(38.74,59.56)
IN-1: length 5.1
  Top Layer w0.381: R37.1 23.37,97.28 24.25,96.4 U9.4
IN-2: length 5.5
  Top Layer w0.381: R38.1 23.62,86.61 24.5,85.73 U10.4
IN-3: length 5.6
  Top Layer w0.381: U11.4 24.5,72.78 23.75,73.53 R39.1
IN-4: length 5.4
  Top Layer w0.381: R40.1 23.75,60.45 24.63,59.57 U12.4
M+: length 83.5
  Bottom Layer w3.048: 58.52,2.03 58.74,2.25 M4.3 ; 58.52,2.03 44.1,2.03 ; 58.52,2.03 61.72,2.03 62.74,3.05 62.74,7.24 70.13,14.64 70.13,23 J2.3 ; 44.1,2.03 44.14,2.07 M3.3 ; 44.1,2.03 29.66,2.03 ; 29.66,2.03 17.84,2.03 M1.3 ; 29.66,2.03 29.79,2.16 M2.3
MDIR1: length 62.9
  Top Layer w0.203: U6.18 51.56,36.7 50.52,35.66 50.52,18.62 50.42,18.52 43.74,18.52 42.16,16.94 15.34,16.94 M1.4
MDIR2: length 45.7
  Top Layer w0.203: M2.4 28.37,16.64 42.29,16.64 43.87,18.21 50.55,18.21 50.83,18.49 50.83,33.3 51.69,34.16 U6.16
MDIR3: length 29
  Top Layer w0.203: U6.14 51.82,31.62 51.13,30.94 51.13,18.36 50.67,17.91 43.99,17.91 M3.4
MDIR4: length 18.9
  Top Layer w0.203: M4.4 51.44,17.09 51.44,28.58 51.94,29.08 U6.12
MESC1: length 53
  Top Layer w0.203: v1(48.01,29.08) U6.9
  Bottom Layer w0.203: v1(48.01,29.08) 49.89,29.08 51.16,27.81 51.16,20.52 47.45,16.81 32.32,16.81 32.14,16.64 19.24,16.64 M1.1
MESC2: length 41.8
  Top Layer w0.203: v1(48.01,31.62) U6.7
  Bottom Layer w0.203: M2.1 32.44,16.51 47.57,16.51 51.46,20.4 51.46,30.84 50.67,31.62 v1(48.01,31.62)
MESC3: length 30.7
  Top Layer w0.203: v1(48.01,34.16) U6.5
  Bottom Layer w0.203: M3.1 45.35,13.85 51.77,20.27 51.77,33.45 51.05,34.16 v1(48.01,34.16)
MESC4: length 31.6
  Top Layer w0.203: v1(48.01,36.7) U6.3
  Bottom Layer w0.203: M4.1 58.41,13.98 52.07,20.32 52.07,34.42 49.78,36.7 v1(48.01,36.7)
RTS: length 21.3
  Top Layer w0.203: 39.12,78.66 39.12,79.76 39.83,80.47 48.6,80.47 52.07,77 52.07,75.51 Q1.2 49.7,73.14 R5.1
RXD0: length 43.7
  Top Layer w0.203: v1(55.5,84.58) 57.66,84.58 59.26,86.18 62.15,86.18 63.58,87.61 63.58,92.97 64.21,93.6 U1.36 ; LED4.2 41.78,87.12 40.39,85.73 U3.2
  Top Layer w0.381: U3.2 v1(40.39,82.55)
  Bottom Layer w0.203: v1(55.5,84.58) 54.99,84.07 54.99,83.49 53.42,81.92 41.02,81.92 v1(40.39,82.55)
RXD1: length 57.1
  Top Layer w0.203: H5.3 62.61,45.21 61.47,46.36 61.47,57.53 v1(62.1,58.17) ; U1.11 52.08,85.98 52.34,85.73 v1(53.85,85.73)
  Bottom Layer w0.203: v1(62.1,58.17) 60.93,59.33 60.93,88.01 60.68,88.27 57.74,88.27 55.19,85.73 v1(53.85,85.73)
S1: length 48.4
  Top Layer w0.203: 32.89,55.63 31.54,55.63 30.99,56.18 30.99,59.94 31.88,60.83 37.67,60.83 38.71,61.87 39.47,61.87 40.26,61.09 v1(40.77,61.09) ; U1.18 v1(56.39,79.12)
  Bottom Layer w0.203: v1(40.77,61.09) 46.25,61.09 50.42,65.25 53.59,65.25 56.67,68.33 56.67,78.84 v1(56.39,79.12)
S2: length 55.2
  Top Layer w0.203: 32.89,50.55 31.54,50.55 30.38,51.71 30.38,60.2 31.62,61.44 37.29,61.44 38.33,62.48 v1(40.39,62.48) ; v1(55.63,76.2) 55.63,76.71 56.52,77.6 57.78,77.6 58.93,78.74 58.93,80.89
  Bottom Layer w0.203: v1(40.39,62.48) 46.79,62.48 50.17,65.86 53.34,65.86 56.06,68.58 56.06,75.77 v1(55.63,76.2)
S3: length 49.1
  Top Layer w0.203: 61.47,80.89 61.47,83.58 60.47,84.58 v1(59.94,84.58)
  Top Layer w0.381: v1(44.32,52.45) 44.32,51.31 43.56,50.55 U5.13
  Bottom Layer w0.203: v1(44.32,52.45) 44.86,52.99 44.86,54.72 45.19,55.05 45.19,58.29 50.93,64.03 54.1,64.03 57.89,67.82 57.89,83.49 58.98,84.58 v1(59.94,84.58)
S4: length 49
  Top Layer w0.203: v1(58.42,87.25) 57.88,87.79 53.32,87.79 52.59,88.52 U1.9
  Top Layer w0.381: U5.17 43.56,55.63 44.32,56.39 v1(44.32,57.53)
  Bottom Layer w0.203: v1(58.42,87.25) 58.42,85.47 57.28,84.33 57.28,68.07 53.85,64.64 50.67,64.64 44.32,58.29 v1(44.32,57.53)
SCL0: length 53.3
  Top Layer w0.203: U8.23 53.2,51.68 v1(52.71,51.18) ; v1(59.18,82.3) 59.44,82.55 59.44,83.31 58.8,83.95 55.63,83.95 55.12,83.44 U1.13
  Top Layer w0.254: v1(49.53,60.07) 49.15,60.45 R20.1
  Bottom Layer w0.203: v1(52.71,51.18) 51.05,51.18 49.53,52.7 v1(49.53,60.07) 49.53,61.78 51.18,63.42 54.35,63.42 58.5,67.57 58.5,81.61 v1(59.18,82.3)
SDA0: length 51.9
  Top Layer w0.203: v1(58.8,83.06) 57.4,83.06 56.9,83.57 55.83,83.57 54.44,82.17 U1.14 ; v1(54.48,51.82) 54.46,51.84 53.96,51.84 53.7,52.09 U8.24
  Top Layer w0.254: v1(50.93,60.07) 50.67,60.33 R21.1
  Bottom Layer w0.203: v1(58.8,83.06) 59.31,83.06 59.82,82.55 59.82,79.73 58.85,78.77 58.85,67.49 54.48,63.12 51.3,63.12 50.93,62.74 v1(50.93,60.07) 55.25,55.75 55.25,52.58 v1(54.48,51.82)
SH1: length 70.5
  Top Layer w0.203: U5.16 37.34,54.36 v1(36.45,55.25)
  Bottom Layer w0.203: 7.36,91.75 9.66,94.06 28.58,94.06 31.06,91.57 31.06,84.33 36.45,78.94 v1(36.45,55.25)
SH2: length 97.1
  Top Layer w0.203: U5.12 40.64,49.28 v1(38.74,51.18)
  Bottom Layer w0.203: v1(38.74,51.18) 38.74,56.13 37.39,57.48 37.39,79.3 31.98,84.71 31.98,91.95 28.95,94.97 21.28,94.97 17.91,98.35 5.59,98.35 4.9,97.66 4.9,81.97 7.31,79.56 L2.4
SH3: length 111.7
  Top Layer w0.203: 32.89,51.82 35,51.82 35.51,52.32 35.51,55.88 36.45,56.82 37.49,56.82 38.74,58.07 v1(38.74,58.42)
  Bottom Layer w0.203: L3.4 4.29,69.29 4.29,97.92 5.34,98.96 18.16,98.96 21.54,95.58 29.21,95.58 32.59,92.2 32.59,84.96 38,79.55 38,59.16 v1(38.74,58.42)
SH4: length 123.1
  Top Layer w0.203: v1(39.12,60.83) 39.08,60.83 37.03,58.78 37.03,57.66 36.81,57.43 36.2,57.43 35.66,56.9 32.89,56.9 ; L4.4 4.14,55.47 4.14,61.01 v1(3.68,61.47)
  Bottom Layer w0.203: v1(39.12,60.83) 39.12,61.59 38.61,62.1 38.61,79.8 33.2,85.21 33.2,92.45 29.46,96.19 21.79,96.19 18.41,99.57 5.08,99.57 3.68,98.17 v1(3.68,61.47)
TEMP: length 62.8
  Top Layer w0.381: v1(59.56,97.41) 68.31,97.41 U1.39 ; v1(44.96,67.44) 45.46,66.94 R8.1 R9.2
  Bottom Layer w0.381: v1(44.96,67.44) 44.96,78.23 42.05,81.14 39.38,81.14 38.35,82.17 38.35,86.49 40.51,88.65 49.02,88.65 52.58,92.2 52.58,95.12 54.86,97.41 v1(59.56,97.41)
TXD0: length 49
  Top Layer w0.203: v1(57.28,85.34) 58.42,86.49 62.03,86.49 63.27,87.73 63.27,93.1 65.05,94.87 U1.37 ; U3.3 39.12,85.98 40.77,87.63 40.77,89.15 41.78,90.17 LED3.2
  Top Layer w0.381: U3.3 v1(39.12,82.55)
  Bottom Layer w0.203: v1(39.12,82.55) 40.13,81.53 53.47,81.53 v1(57.28,85.34)
TXD1: length 57.5
  Top Layer w0.203: U1.10 52.45,87.25 v1(52.71,87) ; v1(61.21,58.17) 61.16,58.12 61.16,46.3 60.07,45.21 H5.4
  Bottom Layer w0.203: v1(61.21,58.17) 60.58,58.8 60.58,87.76 60.38,87.96 57.86,87.96 54.99,85.09 53.57,85.09 53.09,85.57 53.09,86.61 v1(52.71,87)
$1N1222: length 2.6
  Top Layer w0.381: LED5.2 34.04,66.46 R3.2
$1N2133: length 4.9
  Top Layer w0.203: R4.2 50.74,76.39 Q1.1
$1N2136: length 2.1
  Top Layer w0.203: Q2.1 50.97,71.64 R5.2
$1N2741: length 15.3
  Top Layer w0.381: LED4.1 46.35,83.83 50.43,79.76 v1(50.93,79.76) ; R6.1 47.62,76.71 v1(49.4,76.71)
  Bottom Layer w0.381: v1(50.93,79.76) 51.18,79.5 51.18,78.49 v1(49.4,76.71)
$1N2742: length 16.6
  Top Layer w0.381: LED3.1 48.01,88.52 48.01,82.86 50.22,80.65 v1(51.05,80.65) ; v1(48.51,78.99) 47.66,78.99 R7.1
  Bottom Layer w0.381: v1(48.51,78.99) 48.9,79.38 48.9,80.14 49.4,80.65 v1(51.05,80.65)
$1N4890: length 4.9
  Top Layer w0.203: D1.2 38.49,90.07 38.49,91.28 37.74,92.03 USB1.1
$1N6785: length 50.3
  Top Layer w0.203: U1.4 53.6,94.87 54.36,95.63 59.18,95.63 v1(59.44,95.38)
  Bottom Layer w0.203: H1.2 67.12,58.48 67.12,72.35 62.1,77.37 62.1,87.45 61.54,88.01 61.54,93.27 v1(59.44,95.38)
$1N6797: length 53.7
  Top Layer w0.203: U1.5 53.09,93.6 54.56,95.07 58.22,95.07 58.67,94.62 v1(59.31,94.62)
  Bottom Layer w0.203: H2.2 65.06,55.84 65.06,58.56 66.82,60.31 66.82,72.23 61.8,77.24 61.8,87.33 61.24,87.89 61.24,92.76 59.39,94.62 v1(59.31,94.62)
$1N6809: length 57.3
  Top Layer w0.203: v1(61.21,94.49) 60.58,94.49 59.56,93.47 55.37,93.47 54.23,92.33 U1.6
  Bottom Layer w0.203: H3.2 67.43,52.69 67.43,72.48 62.43,77.47 62.43,87.55 61.93,88.06 61.93,94.03 61.47,94.49 v1(61.21,94.49)
$1N6817: length 55.8
  Top Layer w0.203: v1(62.48,88.39) 58.47,88.39 58.29,88.57 53.41,88.57 52.32,89.65 52.32,90.55 51.81,91.06 U1.7
  Bottom Layer w0.203: H4.2 67.73,50.08 67.73,72.61 62.74,77.6 62.74,88.19 62.53,88.39 v1(62.48,88.39)
$2N3281: length 11.2
  Top Layer w0.203: R12.1 19.69,11.95 18.54,10.8 13.39,10.8 M1.5
$2N3526: length 10.6
  Top Layer w0.203: M2.5 27.49,11.56 33.4,11.56 34.04,12.19 34.04,13.33 R14.1
$2N3663: length 11.4
  Top Layer w0.203: R16.1 48.64,13.98 48.64,12.45 47.88,11.68 41.97,11.68 M3.5
$2N3800: length 11.4
  Top Layer w0.203: M4.5 54.54,9.84 56.52,11.81 62.36,11.81 63.13,12.58 R18.1
$2N3957: length 6.2
  Top Layer w0.762: Q5.3 71.88,36.95 J2.4
$2N7741: length 5.3
  Top Layer w0.254: U8.9 52.71,56.65 52.71,57.53 53.59,58.41 R22.2
$2N7753: length 5.4
  Top Layer w0.254: C32.2 52.58,59.82 52.2,59.44 52.2,56.65 U8.10
$2N7759: length 5.1
  Top Layer w0.254: C31.2 51.7,49.45 U8.20
$2N11315: length 26.6
  Top Layer w1.524: J2.2 59.04,23.88 63.5,23.88 67.73,19.65 67.73,5.46 P1.1
$2N16506: length 6.9
  Top Layer w0.254: U8.13 49.97,55.99 49.24,56.72 C30.1 46.86,58.17 46.61,58.42 R41.1

## Copper pours and planes (outline as drawn; the poured copper is in the pictures)
7.4VDC on Top Layer: 21.08,31.75 36.96,31.75 36.96,27.05 21.08,27.05
12.6VDC on Top Layer: 38.23,41.4 42.29,41.4 42.29,37.21 38.23,37.21
+5V on Top Layer: 31.37,75.82 36.07,75.82 36.07,73.41 31.37,73.41
+5V on Top Layer: 19.3,48.9 22.22,48.9 22.22,44.7 19.3,44.7
+5V on Bottom Layer: 20.19,45.08 21.59,45.08 21.59,43.69 20.19,43.69
GND on Top Layer: -5.21,105.28 79.63,105.28 79.63,-5.21 -5.21,-5.21
GND on Bottom Layer: -8.64,107.06 85.47,107.06 85.47,-8.51 -8.64,-8.51
IN-1 on Top Layer: 9.53,93.85 9.53,100 23.02,100 23.02,95.33 19.83,95.33 17.77,97.66 13.46,97.66 13.46,93.85
IN-2 on Top Layer: 23.24,88.65 9.53,88.65 9.54,81.47 13.83,81.47 13.83,85.53 18.52,85.53 19.54,84.51 23.22,84.51
IN-3 on Top Layer: 23.11,75.56 9.4,75.44 9.43,68.45 13.72,68.45 13.72,72.52 18.4,72.52 19.43,71.49 23.11,71.49
IN-4 on Top Layer: 23.24,62.48 9.53,62.48 9.54,54.74 13.84,54.74 13.83,59.37 18.52,59.37 19.54,58.35 23.22,58.35

Small or netless copper shapes (teardrops, artwork), in the pictures only: 348 on Top Layer, 121 on Bottom Layer

## Text on the board
Top Silkscreen Layer: TO Rpi4B PW | GND | +5V | V1.0 | designed by / MackaJunest
